# EAGLE board Arm_Board_2018 (EAGLE 8.2.2), part 1 of 2
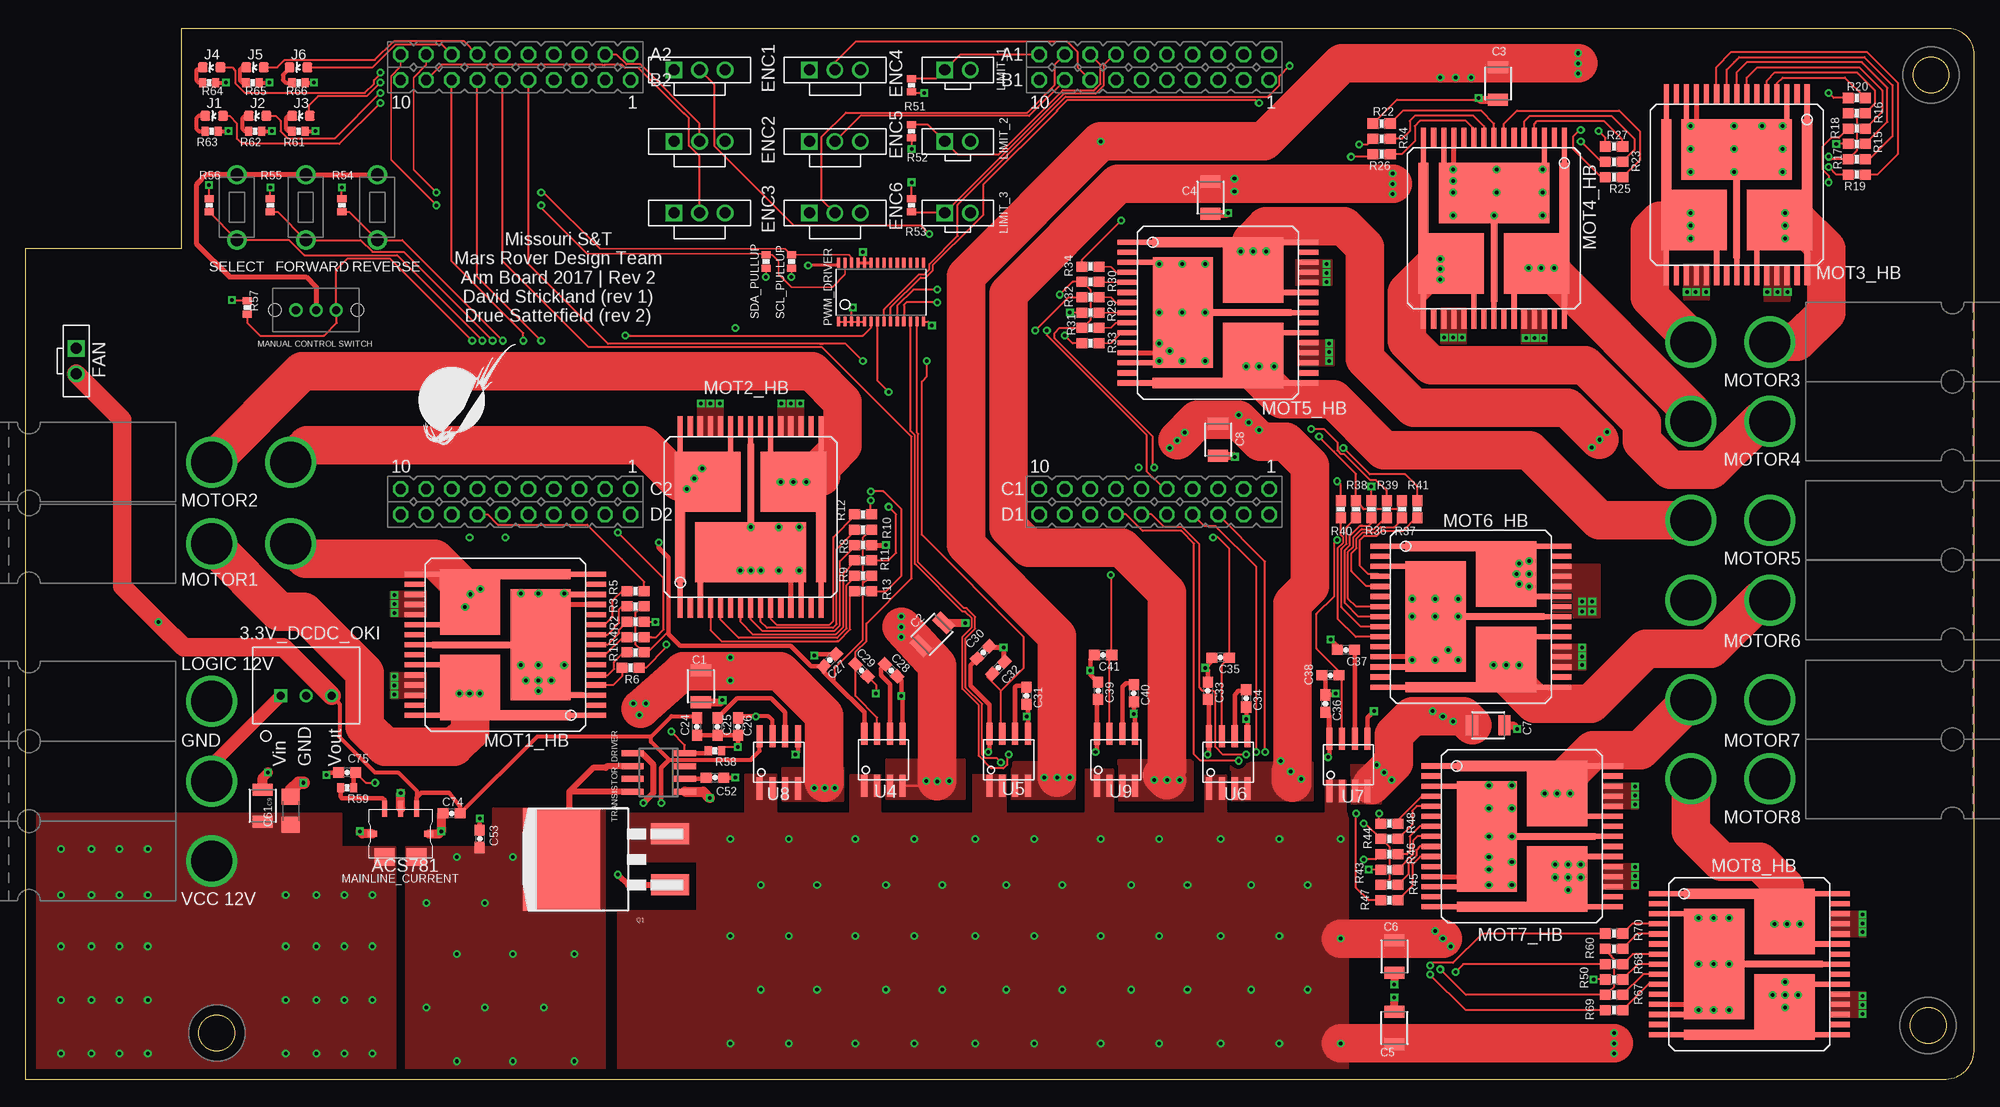
[diagram p4: board, top side]
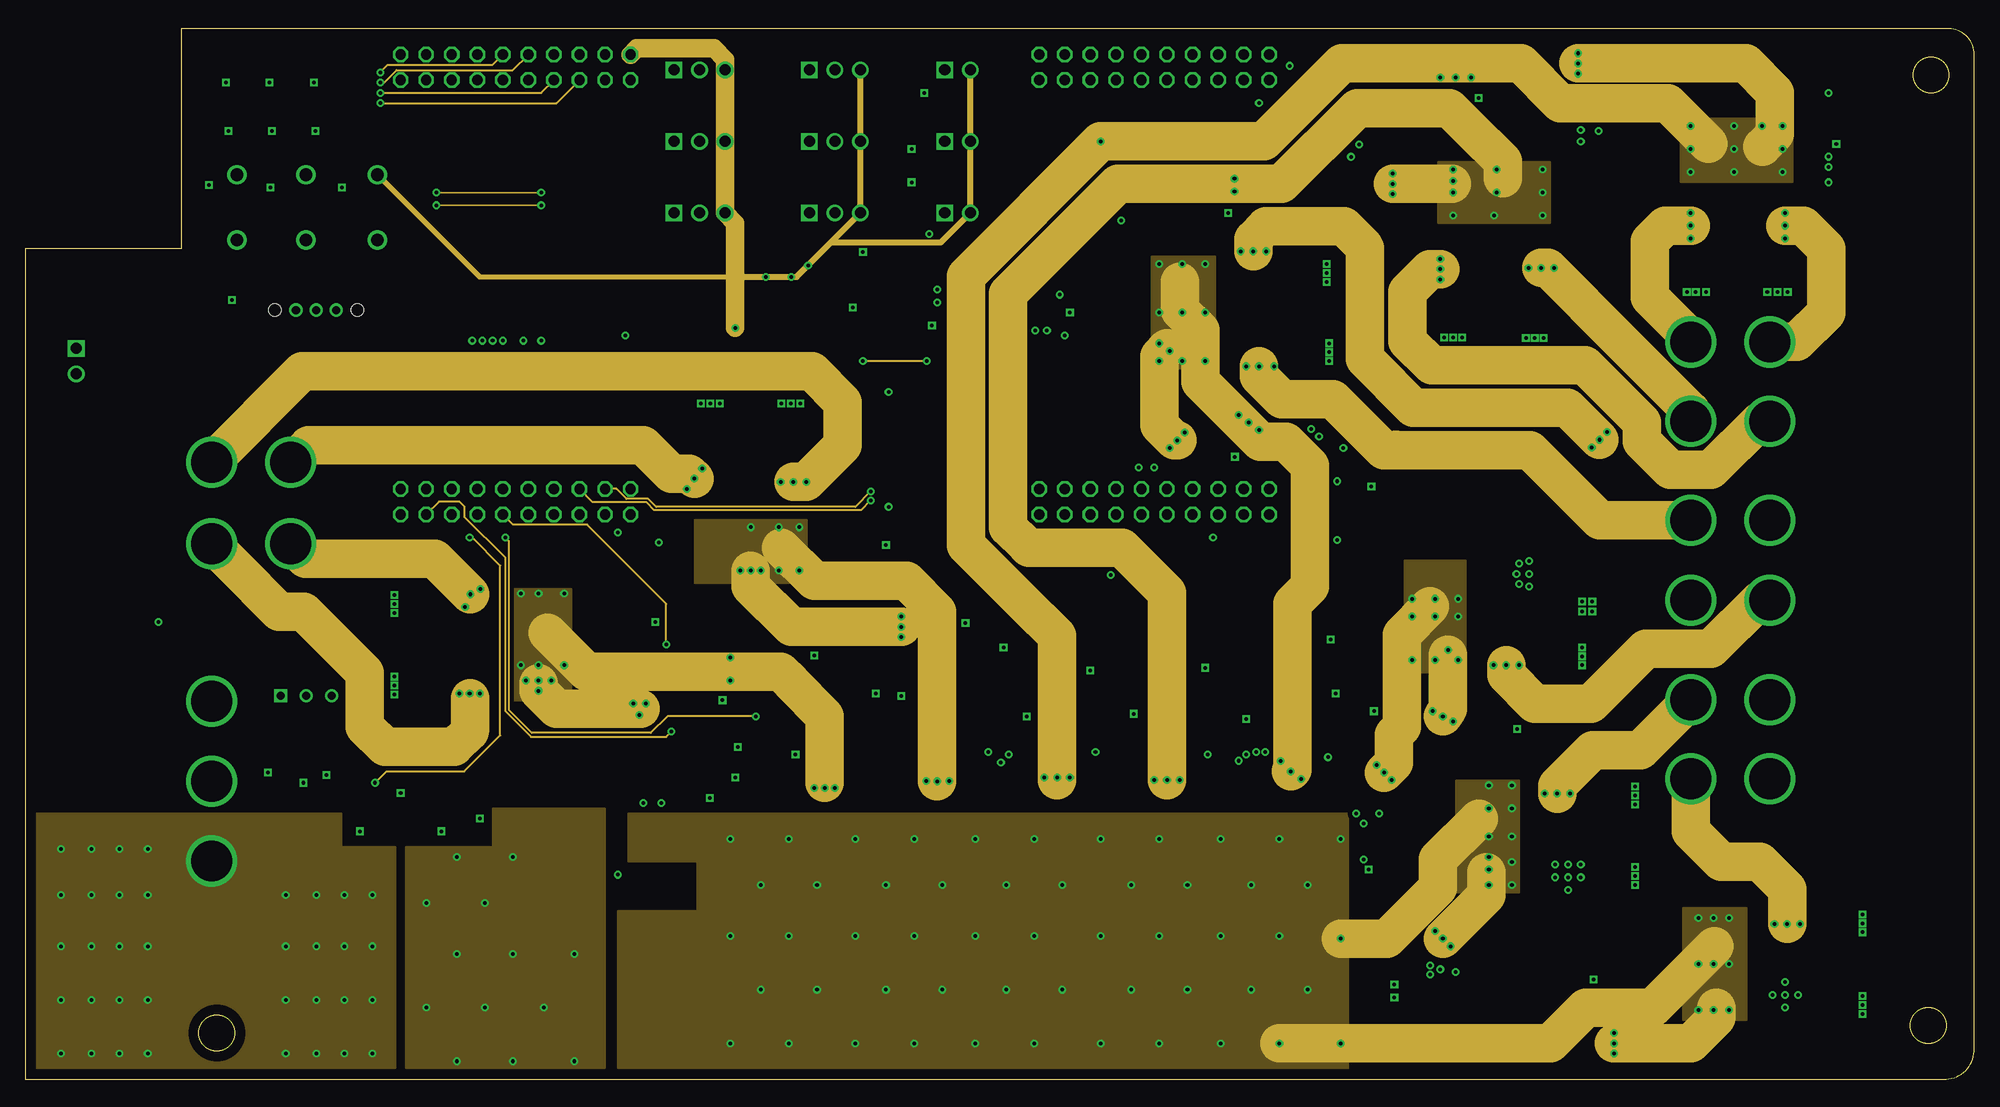
[diagram p5: board, inner layer Route2]
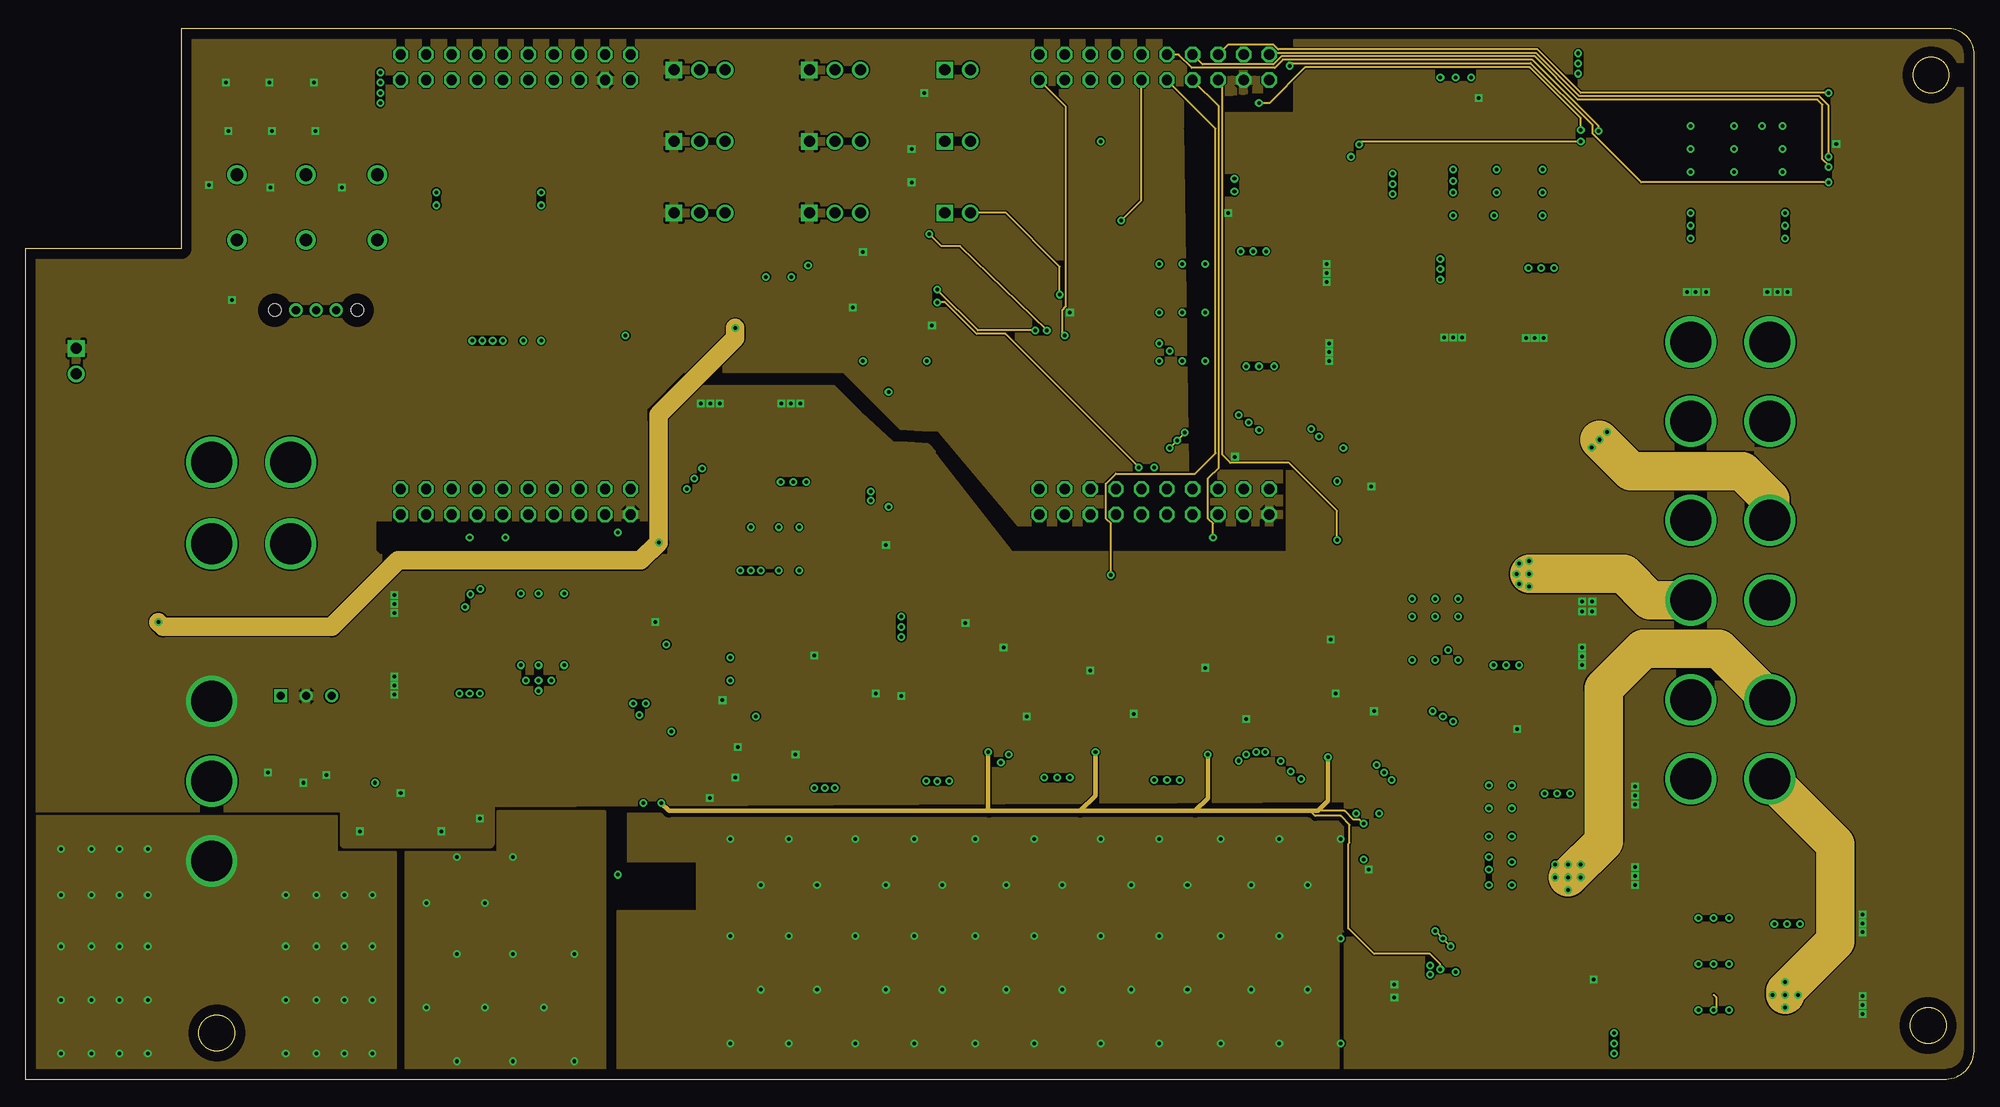
[diagram p6: board, inner layer Route15]
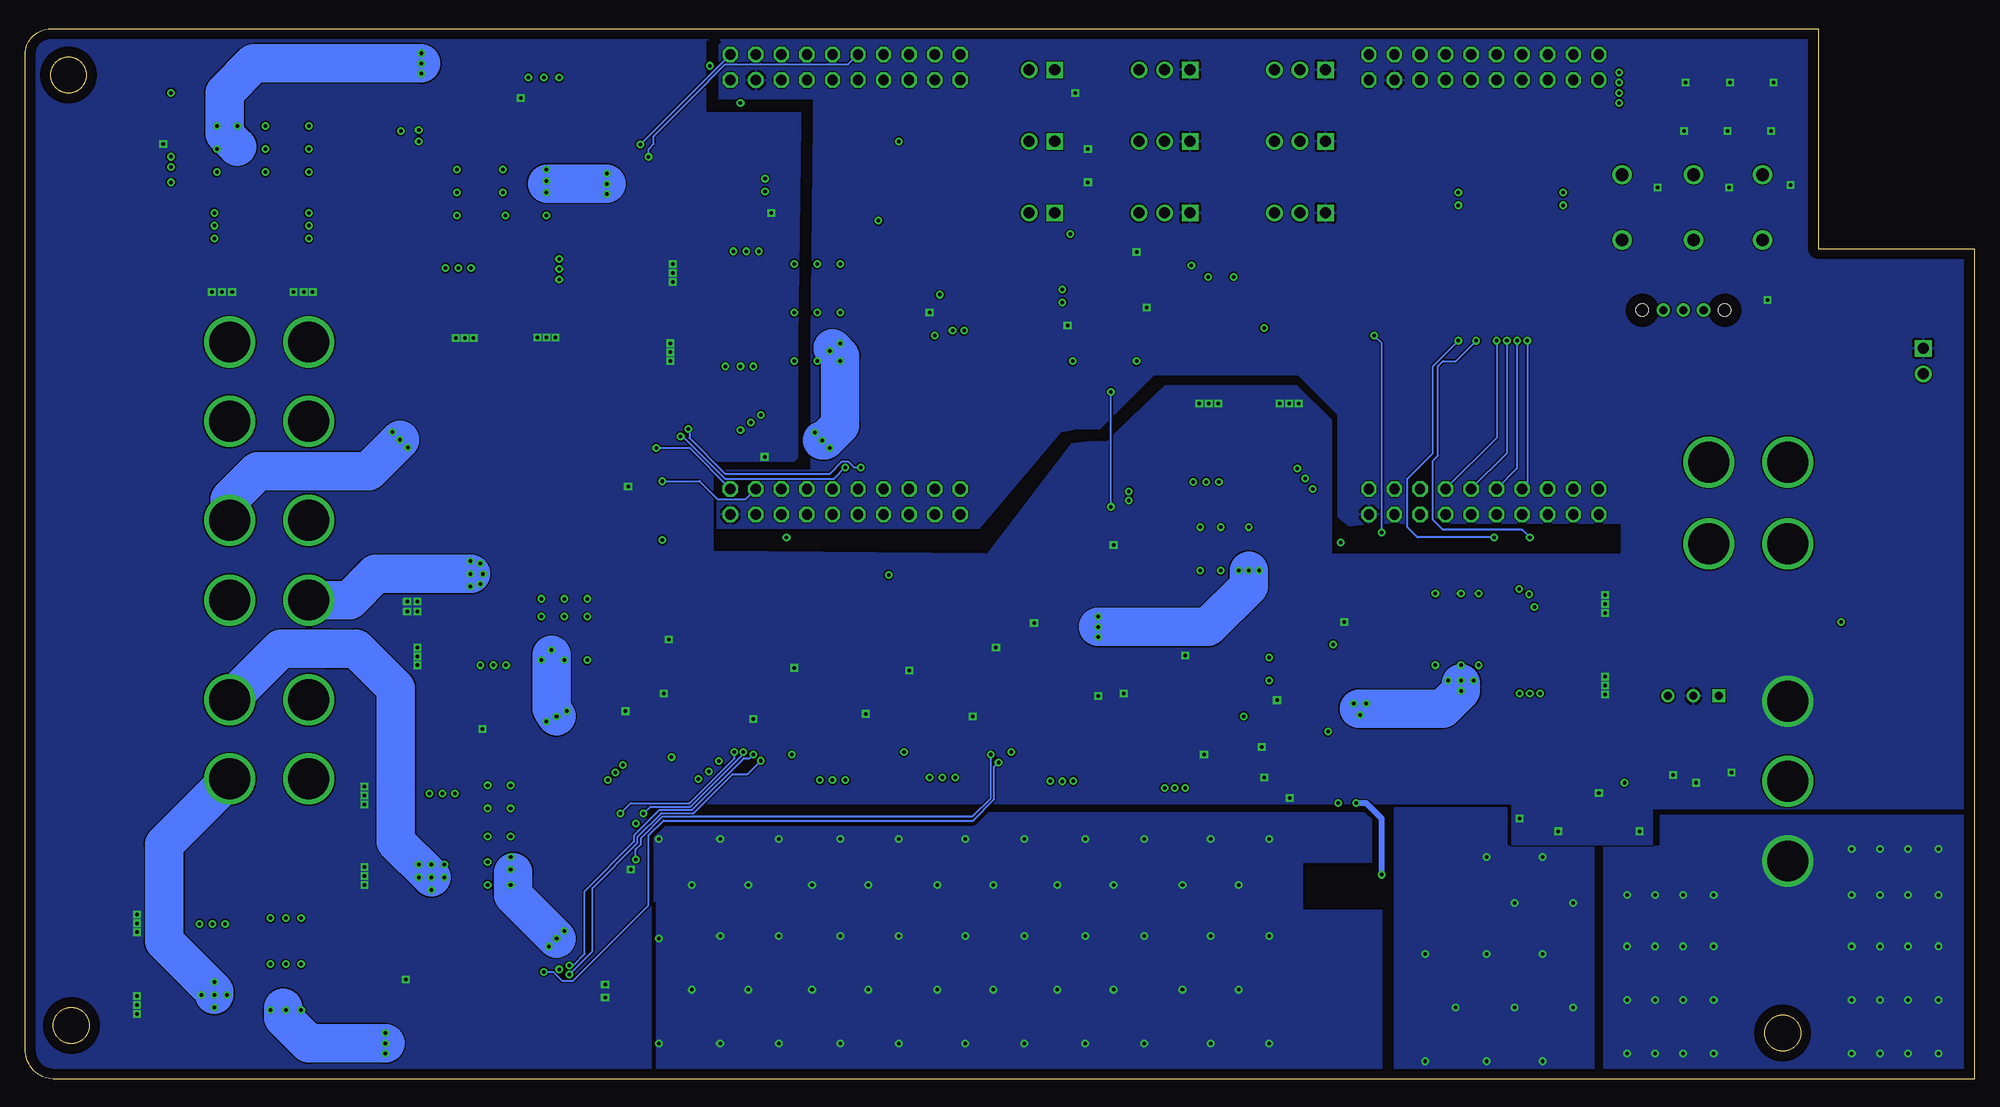
[diagram p7: board, bottom side, seen from below]

Size 193.81 x 104.39 mm. Coordinates in mm from the lower left corner, seen from the top.
Outline: 0,0 191.01,0 arc90 193.8,3.05 193.8,101.6 arc90 191.52,104.39 15.49,104.39 15.49,82.55 0,82.55 0,0
Copper layers (1*2*15*16): Top 0.07mm / dielectric 0.18mm / Route2 0.017mm / dielectric 1.12mm / Route15 0.017mm / dielectric 0.18mm / Bottom 0.07mm
Design rules "advanced_circuits_standard *": minimum track width 5mil, minimum drill 10mil, track to track 5mil, track to pad 5mil, pad to pad 5mil, via to via 5mil, smd to smd 5mil, copper to edge 40mil, drill to drill 5mil, minimum pad ring 10mil, minimum via ring 8mil, stop-mask expansion 4mil, vias tented up to drill 0mil, thermal gap 10mil
Net classes: 2 Ethernet: width 0.22 mm, clearance 0.152 mm; 3 Power Trace: width 1.829 mm, clearance 0.406 mm

## Footprints (pad centres in the part's own frame; a part is rotated, then mirrored left to right if it is on the bottom)
Q_OKI-78SR = drill 0.8 square: 1 -2.54,0 | drill 0.8: 2 0,0; 3 2.54,0
APP45_PCB_HORIZ_RIGHT = drill 4.064: P$1 28.194,3.969
1210 = smd 1.2 x 2: 1 -1.6,0; 2 1.6,0
0603-CAP = smd 1.1 x 1: 1 -0.85,0; 2 0.85,0
1206 = smd 1.6 x 1.8: 1 -1.4,0; 2 1.4,0
LED-0603 = smd 1 x 1: A 0,-0.877; C 0,0.877
MOLEX-70543-0002 = drill 1.1 square: 1 2.54,0 | drill 1.1: 2 0,0; 3 -2.54,0
MOLEX-70543-0001 = drill 1.1 square: 1 1.27,0 | drill 1.1: 2 -1.27,0
7-POWER_SMD_MODULE = smd 0.5 x 1.6: 1 -1.6,-2.5; 2 0,-2.5; 3 1.6,-2.5 | smd 0.9 x 0.6: 4 2.8,0; 7 -2.8,0 | smd 2 x 1.7: 5 1.6,2.3; 6 -1.6,2.3
MULTIPOWERSO-30 = smd 0.508 x 12: 1 -7,-4; 15 7,-4; 16 7,4; 30 -7,4 | smd 0.508 x 2: 2 -6,-9; 4 -4,-9; 5 -3,-9; 6 -2,-9; 7 -1,-9; 8 0,-9; 9 1,-9; 10 2,-9; 11 3,-9; 12 4,-9; 14 6,-9; 17 6,9; 18 5,9; 19 4,9; 20 3,9; 22 1,9; 24 -1,9; 26 -3,9; 27 -4,9; 28 -5,9; 29 -6,9 | smd 0.508 x 4: 3 -5,-8; 13 5,-8; 21 2,8; 23 0,8; 25 -2,8 | smd 6.5 x 6: OUTA -4.25,3.5; OUTB 4.25,3.5 | smd 1 x 7.5: OUTA@1 -7,-2.755; OUTB@1 7,-2.755 | smd 11 x 6: VCC 0,-3.5 | smd 0.65 x 8.3: VCC@1 0,3.145
APP45_HORIZ_CONFIG = drill 4.064: C1 28.194,3.937; C2 36.068,3.937
TSSOP28 = smd 0.305 x 0.991: 1 -4.225,-2.918; 2 -3.575,-2.918; 3 -2.925,-2.918; 4 -2.275,-2.918; 5 -1.625,-2.918; 6 -0.975,-2.918; 7 -0.325,-2.918; 8 0.325,-2.918; 9 0.975,-2.918; 10 1.625,-2.918; 11 2.275,-2.918; 12 2.925,-2.918; 13 3.575,-2.918; 14 4.225,-2.918; 15 4.225,2.918; 16 3.575,2.918; 17 2.925,2.918; 18 2.275,2.918; 19 1.625,2.918; 20 0.975,2.918; 21 0.325,2.918; 22 -0.325,2.918; 23 -0.975,2.918; 24 -1.625,2.918; 25 -2.275,2.918; 26 -2.925,2.918; 27 -3.575,2.918; 28 -4.225,2.918
D2PACK = smd 2.083 x 3.81: 1 2.54,-4.191; 2 7.62,-4.191 | smd 10.16 x 7.62: TAB 5.08,6.604
0603-RES = smd 1.1 x 1: 1 -0.85,0; 2 0.85,0
0402-RES = smd 0.7 x 0.9: 1 -0.65,0; 2 0.65,0
APEM-MJTP1243 = drill 1.27: P$1 -0.254,1.753; P$2 6.248,1.753
C&K-SS12D07VG4NSGAPA = drill 0.8: P$1 0,0; P$2 2,0; P$3 4,0 | hole 1.25: -2.1,0; 6.1,0
SO8 = smd 0.6 x 2.2: 1 -1.905,-2.6; 2 -0.635,-2.6; 3 0.635,-2.6; 4 1.905,-2.6; 5 1.905,2.6; 6 0.635,2.6; 7 -0.635,2.6; 8 -1.905,2.6
TIVA-C-CONNECTED = drill 1.016 octagon: +3V3_1 59.69,54.61; +3V3_2 123.19,54.61; +5V_1 59.69,52.07; +5V_2 123.19,52.07; GND_1 57.15,52.07; GND_2 59.69,8.89; GND_3 120.65,52.07; GND_4 123.19,8.89; PA4 39.37,52.07; PA5 36.83,52.07; PA6 105.41,52.07; PA7 52.07,8.89; PB2 102.87,54.61; PB3 100.33,54.61; PB4 54.61,52.07; PB5 52.07,52.07; PC4 118.11,54.61; PC5 115.57,54.61; PC6 113.03,54.61; PC7 105.41,54.61; PD0 107.95,8.89; PD1 110.49,8.89; PD2 57.15,54.61; PD3 107.95,54.61; PD4 49.53,54.61; PD5 46.99,54.61; PD7 107.95,52.07; PE0 118.11,52.07; PE1 115.57,52.07; PE2 113.03,52.07; PE3 110.49,52.07; PE4 120.65,54.61; PE5 110.49,54.61; PF1 123.19,11.43; PF2 120.65,11.43; PF3 118.11,11.43; PG0 115.57,11.43; PG1 59.69,11.43; PH0 44.45,11.43; PH1 41.91,11.43; PH2 118.11,8.89; PH3 115.57,8.89; PK0 49.53,52.07; PK1 46.99,52.07; PK2 44.45,52.07; PK3 41.91,52.07; PK4 57.15,11.43; PK5 54.61,11.43; PK6 39.37,11.43; PK7 36.83,11.43; PL0 107.95,11.43; PL1 105.41,11.43; PL2 102.87,11.43; PL3 100.33,11.43; PL4 113.03,11.43; PL5 110.49,11.43; PM0 52.07,11.43; PM1 49.53,11.43; PM2 46.99,11.43; PM3 120.65,8.89; PM4 102.87,52.07; PM5 100.33,52.07; PM6 36.83,8.89; PM7 57.15,8.89; PN2 105.41,8.89; PN3 102.87,8.89; PN4 36.83,54.61; PN5 39.37,54.61; PP0 54.61,54.61; PP1 52.07,54.61; PP2 100.33,8.89; PP3 41.91,8.89; PP4 41.91,54.61; PP5 54.61,8.89; PQ0 44.45,54.61; PQ1 39.37,8.89; PQ2/PA3 46.99,8.89; PQ3/PA2 44.45,8.89; RST1 49.53,8.89; RST_2 113.03,8.89
SOIC8 = smd 2.2 x 0.6: 1 -2.6,1.905; 2 -2.6,0.635; 3 -2.6,-0.635; 4 -2.6,-1.905; 5 2.6,-1.905; 6 2.6,-0.635; 7 2.6,0.635; 8 2.6,1.905

## Placement (x,y rotation side)
3.3V_DCDC_OKI  Q_OKI-78SR  [Q_OKI-78SR]  27.94,38.1 0 top
12V_LOGIC_IN  APPPP45_PCB_HORIZ_RIGHT  [APP45_PCB_HORIZ_RIGHT]  -9.65,25.65 0 top
C1  100uF  [1210]  67.18,39.05 270 top
C2  100uF  [1210]  90.18,44.23 45 top
C3  100uF  [1210]  146.45,98.97 270 top
C4  100uF  [1210]  117.86,87.63 270 top
C5  100uF  [1210]  136.14,5.08 90 top
C6  100uF  [1210]  136.14,12.19 270 top
C7  100uF  [1210]  145.48,35.18 0 top
C8  100uF  [1210]  118.62,63.56 270 top
C9  100uF  [1210]  23.62,27.18 270 top
C24  0.1uF  [0603-CAP]  66.8,35.05 90 top
C25  1nF  [0603-CAP]  68.83,35.05 270 top
C26  0.1uF  [0603-CAP]  70.87,35.05 270 top
C27  0.1uF  [0603-CAP]  80.01,41.66 225 top
C28  1nF  [0603-CAP]  86.11,40.64 315 top
C29  0.1uF  [0603-CAP]  83.16,40.64 315 top
C30  0.1uF  [0603-CAP]  95.25,42.42 225 top
C31  1nF  [0603-CAP]  99.57,38.1 270 top
C32  0.1uF  [0603-CAP]  96.77,40.89 45 top
C33  0.1uF  [0603-CAP]  117.6,38.61 270 top
C34  1nF  [0603-CAP]  121.41,37.85 270 top
C35  0.1uF  [0603-CAP]  118.87,41.91 180 top
C36  0.1uF  [0603-CAP]  129.29,37.34 270 top
C37  1nF  [0603-CAP]  131.32,42.67 180 top
C38  0.1uF  [0603-CAP]  129.79,40.13 180 top
C39  0.1uF  [0603-CAP]  106.68,38.61 270 top
C40  1nF  [0603-CAP]  110.24,38.35 270 top
C41  0.1uF  [0603-CAP]  107.19,42.16 180 top
C52  1.0uF  [0603-CAP]  68.58,29.97 0 top
C53  10uF  [0603-CAP]  45.21,23.88 270 top
C61  2.2uF  [1206]  26.42,26.67 270 top
C74  0.1uF  [0603-CAP]  42.42,26.42 180 top
C75  1nF  [0603-CAP]  32,30.48 180 top
D1  J1  [LED-0603]  18.8,95.76 90 top
D2  J2  [LED-0603]  23.11,95.76 90 top
D3  J3  [LED-0603]  27.43,95.76 90 top
D4  J4  [LED-0603]  18.54,100.58 90 top
D5  J5  [LED-0603]  22.86,100.58 90 top
D6  J6  [LED-0603]  27.18,100.58 90 top
ENC1  ENCODER  [MOLEX-70543-0002]  67.06,100.33 180 top
ENC2  ENCODER  [MOLEX-70543-0002]  67.06,93.22 180 top
ENC3  ENCODER  [MOLEX-70543-0002]  67.06,86.11 180 top
ENC4  ENCODER  [MOLEX-70543-0002]  80.52,100.33 180 top
ENC5  ENCODER  [MOLEX-70543-0002]  80.52,93.22 180 top
ENC6  ENCODER  [MOLEX-70543-0002]  80.52,86.11 180 top
FAN  SL02  [MOLEX-70543-0001]  5.08,71.37 90 top
GND  APPPP45_PCB_HORIZ_RIGHT  [APP45_PCB_HORIZ_RIGHT]  -9.65,33.59 0 top
H1  MOUNTING_HOLE#6  [#6_SCREW]  189.23,5.33 0 top
H2  MOUNTING_HOLE#6  [#6_SCREW]  19.05,4.57 0 top
H3  MOUNTING_HOLE#6  [#6_SCREW]  189.48,99.82 0 top
LIMIT_1  SL02  [MOLEX-70543-0001]  92.71,100.33 180 top
LIMIT_2  SL02  [MOLEX-70543-0001]  92.71,93.22 180 top
LIMIT_3  SL02  [MOLEX-70543-0001]  92.71,86.11 180 top
LOGO1  MRDT_LOGO  [MRDT_LOGO]  39.12,62.23 0 top
MAINLINE_CURRENT  ACS781  [7-POWER_SMD_MODULE]  37.34,24.38 180 top
MOT1_HB  VNH5019  [MULTIPOWERSO-30]  47.75,43.18 90 top
MOT2_HB  VNH5019  [MULTIPOWERSO-30]  72.14,55.88 0 top
MOT3_HB  VNH5019  [MULTIPOWERSO-30]  170.18,88.9 180 top
MOT4_HB  VNH5019  [MULTIPOWERSO-30]  146.05,84.58 180 top
MOT5_HB  VNH5019  [MULTIPOWERSO-30]  118.62,76.2 270 top
MOT6_HB  VNH5019  [MULTIPOWERSO-30]  143.76,45.97 270 top
MOT7_HB  VNH5019  [MULTIPOWERSO-30]  148.84,24.13 270 top
MOT8_HB  VNH5019  [MULTIPOWERSO-30]  171.45,11.43 270 top
MOTOR1  APP_2POS_CONFIGGENERAL_CONFIG  [APP45_HORIZ_CONFIG]  -9.65,49.28 0 top
MOTOR2  APP_2POS_CONFIGGENERAL_CONFIG  [APP45_HORIZ_CONFIG]  -9.65,57.4 0 top
MOTOR3  APP_2POS_CONFIGGENERAL_CONFIG  [APP45_HORIZ_CONFIG]  201.68,77.22 180 top
MOTOR4  APP_2POS_CONFIGGENERAL_CONFIG  [APP45_HORIZ_CONFIG]  201.68,69.34 180 top
MOTOR5  APP_2POS_CONFIGGENERAL_CONFIG  [APP45_HORIZ_CONFIG]  201.68,59.5 180 top
MOTOR6  APP_2POS_CONFIGGENERAL_CONFIG  [APP45_HORIZ_CONFIG]  201.68,51.56 180 top
MOTOR7  APP_2POS_CONFIGGENERAL_CONFIG  [APP45_HORIZ_CONFIG]  201.68,41.66 180 top
MOTOR8  APP_2POS_CONFIGGENERAL_CONFIG  [APP45_HORIZ_CONFIG]  201.68,33.78 180 top
POWER_12V  APPPP45_PCB_HORIZ_RIGHT  [APP45_PCB_HORIZ_RIGHT]  -9.65,17.72 0 top
PWM_DRIVER  [TSSOP28]  85.09,78.23 0 top
Q1  Q_IRF7437SMD  [D2PACK]  59.94,16.76 90 top
R1  1K  [0603-RES]  60.71,42.42 0 top
R2  1K  [0603-RES]  60.71,45.47 180 top
R3  1K  [0603-RES]  60.71,46.99 0 top
R4  1K  [0603-RES]  60.71,43.94 0 top
R5  1K  [0603-RES]  60.71,48.51 0 top
R6  1K  [0603-RES]  60.2,40.89 0 top
R8  1K  [0603-RES]  83.31,53.09 180 top
R9  1K  [0603-RES]  83.31,50.04 0 top
R10  1K  [0603-RES]  83.31,54.61 0 top
R11  1K  [0603-RES]  83.31,51.56 0 top
R12  1K  [0603-RES]  83.31,56.13 0 top
R13  1K  [0603-RES]  83.31,48.51 0 top
R15  1K  [0603-RES]  182.12,92.96 0 top
R16  1K  [0603-RES]  182.12,96.01 180 top
R17  1K  [0603-RES]  182.12,91.44 180 top
R18  1K  [0603-RES]  182.12,94.49 180 top
R19  1K  [0603-RES]  182.12,89.92 180 top
R20  1K  [0603-RES]  182.12,97.54 180 top
R22  1K  [0603-RES]  134.87,95 0 top
R23  1K  [0603-RES]  157.99,91.19 180 top
R24  1K  [0603-RES]  134.87,93.47 180 top
R25  1K  [0603-RES]  157.99,89.66 180 top
R26  1K  [0603-RES]  134.87,91.95 180 top
R27  1K  [0603-RES]  157.99,92.71 180 top
R29  1K  [0603-RES]  105.92,76.2 0 top
R30  1K  [0603-RES]  105.92,79.25 180 top
R31  1K  [0603-RES]  105.92,74.68 180 top
R32  1K  [0603-RES]  105.92,77.72 180 top
R33  1K  [0603-RES]  105.92,73.15 180 top
R34  1K  [0603-RES]  105.92,80.77 180 top
R36  1K  [0603-RES]  133.86,56.64 270 top
R37  1K  [0603-RES]  136.91,56.64 90 top
R38  1K  [0603-RES]  132.33,56.64 90 top
R39  1K  [0603-RES]  135.38,56.64 90 top
R40  1K  [0603-RES]  130.81,56.64 90 top
R41  1K  [0603-RES]  138.43,56.64 90 top
R43  1K  [0603-RES]  135.64,20.83 0 top
R44  1K  [0603-RES]  135.64,23.88 180 top
R45  1K  [0603-RES]  135.64,19.3 180 top
R46  1K  [0603-RES]  135.64,22.35 180 top
R47  1K  [0603-RES]  135.64,17.78 180 top
R48  1K  [0603-RES]  135.64,25.4 180 top
R50  1K  [0603-RES]  157.99,9.91 0 top
R51  10K  [0402-RES]  88.14,98.81 90 top
R52  10K  [0402-RES]  88.14,94.23 90 top
R53  10K  [0402-RES]  88.14,86.87 270 top
R54  10k  [0402-RES]  31.5,86.87 90 top
R55  10k  [0402-RES]  24.38,86.87 90 top
R56  10k  [0402-RES]  18.29,86.87 90 top
R57  10k  [0402-RES]  22.1,76.71 90 top
R58  10K  [0402-RES]  68.58,32.64 180 top
R59  1K  [0402-RES]  32,28.96 180 top
R60  1K  [0603-RES]  157.99,12.95 180 top
R61  330  [0402-RES]  27.18,94.23 180 top
R62  330  [0402-RES]  22.86,94.23 180 top
R63  330  [0402-RES]  18.54,94.23 180 top
R64  330  [0402-RES]  18.29,99.06 180 top
R65  330  [0402-RES]  22.61,99.06 180 top
R66  330  [0402-RES]  27.18,99.06 180 top
R67  1K  [0603-RES]  157.99,8.38 180 top
R68  1K  [0603-RES]  157.99,11.43 180 top
R69  1K  [0603-RES]  157.99,6.86 180 top
R70  1K  [0603-RES]  157.99,14.48 180 top
S2  PUSHBUTTONVERT  [APEM-MJTP1243]  19.3,89.66 270 top
S3  PUSHBUTTONVERT  [APEM-MJTP1243]  26.16,89.66 270 top
S4  PUSHBUTTONVERT  [APEM-MJTP1243]  33.27,89.66 270 top
S5  SWITCH-SPDTVERT  [C&K-SS12D07VG4NSGAPA]  26.92,76.45 0 top
SCL_PULLUP  1K  [0402-RES]  76.2,81.28 90 top
SDA_PULLUP  1K  [0402-RES]  73.66,81.28 90 top
TRANSISTOR_DRIVER  LT1910  [SO8]  62.99,30.48 90 top
U1  TIVA-1294  [TIVA-C-CONNECTED]  0.51,47.24 0 top
U4  ACS722  [SOIC8]  85.34,31.75 90 top
U5  ACS722  [SOIC8]  97.79,31.75 90 top
U6  ACS722  [SOIC8]  119.63,31.5 90 top
U7  ACS722  [SOIC8]  131.57,31.24 90 top
U8  ACS722  [SOIC8]  74.93,31.5 90 top
U9  ACS722  [SOIC8]  108.46,31.75 90 top

## Tracks (layer width: path | path; a pad name or v marks a point on that pad's centre or on a via)
12VMOTOR_POWER  (via drill 0.35)  (2 unrouted)
  Top 0.152: v167.89,6.86 167.95,6.91 MOT8_HB.VCC 167.95,8.44 v166.37,6.86
  Top 0.203: MOT7_HB.3 140.92,29.21 142.75,29.21 145.34,26.61 MOT7_HB.VCC 145.34,23.76 | 145.54,24.89 146.05,24.38 147.57,24.38 v147.83,24.13 MOT7_HB.VCC@1 MOT7_HB.23 | MOT8_HB.13 166.2,6.43 v167.89,6.86 | MOT8_HB.VCC 167.95,15.18 166.88,16.26 166.12,16.26 165.86,16.51 163.53,16.51 MOT8_HB.3 | MOT8_HB.VCC MOT8_HB.VCC@1 MOT8_HB.23 | MOT8_HB.VCC 167.95,8.58 | 167.95,7.31 168.15,7.11 | v157.99,4.57 v157.99,3.56 v157.99,2.54 | 143.51,19.3 143.34,19.13 142.57,19.13 | 142.57,19.13 MOT7_HB.13 | 142.57,19.13 v145.54,20.83 | MOT8_HB.VCC 168.66,12.14 168.66,13.97
  Top 0.457: MOT8_HB.VCC 166.93,12.45 166.93,13.97
  Top 0.508: MOT7_HB.12 143.57,20.13 | v145.54,20.83 143.57,20.13 | 145.54,24.89 145.34,24.69 MOT7_HB.VCC 145.34,25.09 143.51,26.92 | 143.51,19.3 143.51,20.07 143.57,20.13 | MOT8_HB.12 166.56,7.43 v167.89,6.86
  Top 0.813: C6.1 135.71,14.3 135.38,13.97 | C5.1 136.14,3.56
  Top 3.81: MOT7_HB.VCC 145.34,20.63 145.29,20.57 | v140.97,13.97 135.38,13.97 v130.81,13.97 | v130.81,3.56 136.14,3.56 v157.99,3.56
  Route2 0.203: 168.66,13.97 168.97,13.66 168.97,12.19
  Route2 3.81: 145.29,20.57 145.29,18.29 v140.97,13.97 | v130.81,13.97 135.38,13.97 140.46,19.05 140.46,21.84 144.53,25.91 | 168.15,7.11 168.15,6.1 165.61,3.56 v157.99,3.56 | v124.71,3.56 151.64,3.56 155.19,7.11 161.85,7.11 167.95,13.21
  Route15 0.203: 168.15,7.11 168.15,8.13 167.89,8.38 | v141.73,13.21 v140.97,13.97 v140.21,14.73
  Bottom 3.81: v140.97,13.97 145.29,18.29 145.29,20.57 | v157.99,3.56 165.61,3.56 168.15,6.1 168.15,7.11
  other vias: 78.74,19.3 73.15,19.3 78.74,8.89 73.15,8.89 75.95,14.22 70.1,14.22 75.95,3.56 70.1,3.56 75.95,23.88 70.1,23.88 91.19,19.3 85.6,19.3 91.19,8.89 85.6,8.89 88.39,14.22 82.55,14.22 88.39,3.56 82.55,3.56 88.39,23.88 82.55,23.88 103.12,19.3 97.54,19.3 103.12,8.89 97.54,8.89 100.33,14.22 94.49,14.22 100.33,3.56 94.49,3.56 100.33,23.88 94.49,23.88 115.57,19.3 109.98,19.3 115.57,8.89 109.98,8.89 112.78,14.22 106.93,14.22 112.78,3.56 106.93,3.56 112.78,23.88 106.93,23.88 127.51,19.3 121.92,19.3 127.51,8.89 121.92,8.89 124.71,14.22 118.87,14.22 118.87,3.56 124.71,23.88 118.87,23.88 130.81,23.88 145.54,19.3 147.83,29.21 147.83,26.92 147.83,21.59 147.83,19.3 145.54,22.1 145.54,24.13 145.54,26.92 145.54,29.21 169.42,6.86 169.42,11.43 167.89,11.43 166.37,11.43 169.42,16 167.89,16 166.37,16
  pour Top (no thermals): 117.35,26.16 117.35,30.23 119.38,30.23 119.38,26.16
  pour Top (no thermals): 97.54,26.42 97.54,30.23 94.23,30.23 94.23,26.42
  pour Top (no thermals): 74.68,30.23 71.63,30.23 71.63,26.16 74.68,26.16
  pour Top (no thermals): 85.01,30.25 85.01,25.7 82.07,25.7 82.07,30.25
  pour Top (no thermals): 108.2,26.16 108.2,30.73 105.41,30.73 105.41,26.16
  pour Top (no thermals): 129.29,29.72 131.32,29.72 131.32,26.16 129.29,26.16
  pour Top (no thermals): 59.94,26.42 59.94,21.59 66.8,21.59 66.8,16.76 58.93,16.76 58.93,1.02 131.57,1.02 131.57,26.42
  pour Route2 (no thermals): 59.94,26.42 59.94,21.59 66.8,21.59 66.8,16.76 58.93,16.76 58.93,1.07 131.57,1.02 131.57,26.42
  pour Bottom (rank 2): 59.94,26.42 131.57,26.42 131.57,1.02 58.93,1.02 58.93,16.76 66.8,16.76 66.8,21.59 59.94,21.59
  pour Route15 (rank 2): 59.94,26.42 131.57,26.42 131.57,1.02 58.93,1.02 58.93,16.76 66.8,16.76 66.8,21.59 59.94,21.59
  pour Route2: 142.24,29.72 142.24,18.54 148.59,18.54 148.59,29.72
  pour Route2: 164.85,17.02 164.85,5.84 171.2,5.84 171.2,17.02
BUTTON1  (via drill 0.35)
  Top 0.203: v45.47,73.41 36.97,81.9 27.76,81.9 26.24,83.41 S2.P$2 21.06,83.45 R56.1 18.25,86.22
  Bottom 0.203: v45.47,73.41 45.47,60.71 U1.PM2
BUTTON2  (via drill 0.35)
  Top 0.203: v46.48,73.41 37.66,82.23 34.54,82.23 33.36,83.41 S3.P$2 25.11,86.22 R55.1
  Bottom 0.203: v46.48,73.41 46.48,62.23 U1.PM1
BUTTON3  (via drill 0.35)
  Top 0.203: v47.5,73.41 37.49,83.41 S4.P$2 32.22,86.22 R54.1
  Bottom 0.203: v47.5,73.41 47.5,63.75 U1.PM0
ENCODER_1  (via drill 0.35)
  Top 0.203: 101.62,73.94 111.51,64.05 111.51,60.45 113.28,58.67 U1.PL4 | 101.62,73.94 101.6,73.95 | ENC1.2 68.54,98.84 68.54,92.75 76.45,84.84 89.08,84.84 v89.92,84 | v101.6,74.42 101.6,73.95 | 101.6,73.95 101.62,73.94
  Route15 0.203: v101.6,74.42 92.96,82.8 91.11,82.8 v89.92,84
ENCODER_2
  Top 0.203: U1.PD2 58.8,101.85 59.79,100.86 61.19,100.86 67.06,95 ENC2.2
ENCODER_3
  Top 0.203: U1.PA4 41.4,100.84 57.4,100.84 57.63,100.84 59.35,100.84 59.65,100.53 60.95,100.53 65.47,96.01 65.53,96.01 66,95.54 66,92.78 67.06,91.73 ENC3.2
ENCODER_4
  Top 0.203: U1.PA6 104.65,100.58 104.65,102.11 103.63,103.12 82.55,103.12 80.52,101.09 ENC4.2
ENCODER_5
  Top 0.203: ENC5.2 83.06,95.76 99.82,95.76 U1.PM4
ENCODER_6
  Top 0.203: U1.PB2 102.36,100.84 102.36,98.81 99.64,96.09 81.61,96.09 79.21,93.69 79.21,87.41 ENC6.2
GND  (via drill 0.35)
  Top 0.203: MAINLINE_CURRENT.4 | MAINLINE_CURRENT.7 | C29.2 84.58,39.22 v84.58,38.35 | 99.69,36.07 v99.58,36.07 | R58.1 69.23,32.65 69.6,33.02 v70.86,33.02 v70.87,33.02 | R50.1 v155.96,9.91 | R43.1 v133.6,20.83 | R36.1 v133.86,58.93 | R15.1 v180.09,92.96 | R29.1 v103.89,76.2 | R2.1 62.65,45.47 v62.67,45.44 | R54.2 v31.5,88.65 | R55.2 v24.38,88.65 | R56.2 v18.29,88.9 | R51.1 87.74,98.04 v89.41,98.04 | R52.1 v88.14,92.46 | R53.1 v88.14,89.15 | PWM_DRIVER.24 83.47,82.06 v83.31,82.22 | PWM_DRIVER.1 PWM_DRIVER.2 PWM_DRIVER.3 | PWM_DRIVER.3 PWM_DRIVER.4 PWM_DRIVER.5 | PWM_DRIVER.3 82.17,76.58 v82.3,76.71 | PWM_DRIVER.14 89.79,75.31 v90.17,74.93 | R22.1 136.4,97.37 144.69,97.37 | R57.2 20.69,77.36 v20.57,77.47
  Top 0.305: PWM_DRIVER.25 PWM_DRIVER.24 PWM_DRIVER.23
  Top 0.406: R66.1 v28.7,99.06 | R65.1 v24.28,99.06 | R64.1 v19.96,99.06 | R61.1 v28.85,94.23 | R62.1 v24.54,94.23 | R63.1 v20.22,94.23
  Top 0.457: C52.2 v70.61,29.97 | C53.1 v45.21,25.91 | C75.2 30.23,30.48 v29.97,30.23 | C24.1 C25.2 C26.2 v70.87,33.02 | U4.5 87.25,37.98 v87.13,38.1 87.13,39.61 C28.2 | U5.5 99.69,36.07 99.69,37.12 C31.2 | C40.2 v110.24,36.32 110.36,36.2 U9.5 | C34.2 121.42,36.98 v121.42,35.81 121.54,35.7 U6.5 | 95.85,42.83 C30.1 | U8.5 76.83,32.49 v76.6,32.26 | C27.1 78.63,42.26 v78.49,42.11 | C39.1 105.92,40.22 v105.92,40.64 105.92,41.74 C41.2 | C33.1 117.6,40.64 v117.35,40.89 118.02,41.57 C35.2 | C37.2 130.47,43.01 v129.79,43.69 | U7.5 133.48,35.94 v134.11,36.58 | C38.2 129.29,39.79 C36.1 130.14,38.19 v130.3,38.35
  Top 0.508: R8.1 v85.6,53.09 | C32.2 97.28,41.59 v97.28,42.93 95.94,42.93 C30.1
  Top 0.813: C7.2 147.96,35.18 v148.34,34.8 | C6.2 v136.14,9.4 | C5.2 v136.14,8.13 | C8.2 120.19,61.96 v120.29,61.87 | C4.2 119.56,86.03 v119.63,86.11 | C3.2 144.69,97.37 v144.53,97.54 | C1.2 69.13,37.45 v69.34,37.67 | C2.2 v93.5,45.36
  Top 0.914: MAINLINE_CURRENT.2 v37.34,28.45 | MAINLINE_CURRENT.7 41.15,24.38 v41.4,24.64 41.4,26.25 C74.2 | MAINLINE_CURRENT.4 33.53,24.38 v33.27,24.64
  Top 1.016: TRANSISTOR_DRIVER.1 67.44,28.57 v68.07,27.94 | C9.1 23.62,29.97 v24.13,30.48
  Top 1.219: C61.1 26.42,28.7 27.18,29.46 v27.69,29.46
  other vias: 36.7,40.01 36.7,39.12 36.7,38.23 36.7,48.13 36.7,47.24 36.7,46.35 67.18,67.18 69.09,67.18 68.14,67.18 75.18,67.18 77.09,67.18 76.14,67.18 167.13,78.23 166.12,78.23 165.23,78.23 173.23,78.23 174.24,78.23 175.26,78.23 151,73.66 150.11,73.66 149.22,73.66 142.88,73.72 141.99,73.72 141.1,73.72 129.41,81.03 129.41,80.14 129.41,79.25 129.67,73.15 129.67,72.26 129.67,71.37 154.81,42.93 154.81,42.04 154.81,41.15 154.81,47.5 154.81,46.48 155.83,47.5 155.83,46.48 160.08,29.08 160.08,28.19 160.08,27.3 160.08,21.08 160.08,20.19 160.08,19.3 182.69,16.38 182.69,15.49 182.69,14.61 182.69,8.26 182.69,7.37 182.69,6.48
  pour Bottom: -2.29,84.33 -2.67,98.3 -2.41,104.52 -2.29,104.65 4.57,106.81 36.32,107.7 197.36,105.66 196.09,-2.03 131.57,-1.78 131.57,27.43 45.97,27.43 45.97,23.37 32,23.37 32,26.92 -2.29,26.92
  pour Route15: -2.79,26.92 -2.79,97.54 -2.54,104.9 4.57,104.9 39.37,106.93 201.42,106.93 197.36,-1.52 197.1,-1.78 131.57,-1.27 131.57,27.94 46.23,27.43 46.23,23.37 31.75,23.37 31.75,26.92
  cutout Bottom: 35.31,52.32 63.75,52.32 63.75,65.53 67.31,69.09 80.52,69.09 86.36,63.5 87.63,63.5 89.92,63.25 98.3,52.32 125.22,52.58 125.22,60.71 115.82,60.71 115.82,73.41 115.57,95 115.57,97.28 124.97,97.28 124.97,102.87 124.71,103.12 124.97,103.38 125.98,103.12 125.98,96.27 116.59,96.27 116.59,95 116.84,73.41 116.84,61.72 117.35,61.21 125.22,61.21 125.22,54.61 98.81,54.61 90.68,64.26 89.41,64.52 86.87,64.52 81.53,69.85 67.31,69.85 63.5,66.04 63.5,55.88 62.23,54.86 60.2,55.12 35.31,55.12
  cutout Route15: 35.05,55.37 62.23,55.37 61.98,66.55 65.53,70.1 81.28,70.1 86.87,64.52 90.68,64.26 98.55,54.86 125.22,54.86 125.22,61.47 125.22,61.21 117.35,61.21 116.84,61.72 116.33,94.49 116.33,96.27 125.98,96.27 125.98,103.12 124.97,103.12 124.97,98.04 115.32,97.28 115.32,94.49 115.82,60.71 125.22,60.71 125.22,52.58 98.3,52.58 90.93,61.98 90.68,62.23 90.68,62.48 89.92,63.25 86.36,63.5 83.31,66.29 80.52,69.09 67.31,69.09 63.75,65.79 63.75,52.32 35.31,52.32 35.05,52.58
  pour Top (no thermals): 39.88,40.39 36.32,40.39 36.32,37.85 39.88,37.85
  pour Top (no thermals): 39.88,48.51 36.32,48.51 36.32,45.97 39.88,45.97
  pour Top (no thermals): 66.87,67.44 66.87,63.88 69.41,63.88 69.41,67.44
  pour Top (no thermals): 74.87,67.44 74.87,63.88 77.41,63.88 77.41,67.44
  pour Top (no thermals): 167.45,77.47 167.45,81.03 164.91,81.03 164.91,77.47
  pour Top (no thermals): 175.45,77.34 175.45,80.9 172.91,80.9 172.91,77.34
  pour Top (no thermals): 151.32,73.03 151.32,76.58 148.78,76.58 148.78,73.03
  pour Top (no thermals): 143.32,73.09 143.32,76.64 140.78,76.64 140.78,73.09
  pour Top (no thermals): 129.92,81.47 126.36,81.47 126.36,78.93 129.92,78.93
  pour Top (no thermals): 130.11,73.47 126.56,73.47 126.56,70.93 130.11,70.93
  pour Top (no thermals): 155.26,43.24 151.7,43.24 151.7,40.7 155.26,40.7
  pour Top (no thermals): 156.59,51.18 151.76,51.18 151.76,45.85 156.59,45.85
  pour Top (no thermals): 160.4,29.4 156.84,29.4 156.84,26.86 160.4,26.86
  pour Top (no thermals): 160.4,21.4 156.84,21.4 156.84,18.86 160.4,18.86
  pour Top (no thermals): 183.01,8.7 179.45,8.7 179.45,6.16 183.01,6.16
  pour Top (no thermals): 183.01,16.7 179.45,16.7 179.45,14.16 183.01,14.16
LED1  (via drill 0.35)
  Top 0.203: D1.A 20.32,95.76 21.08,95 21.08,93.47 21.59,92.96 31.24,92.96 v35.31,97.03
  Route2 0.203: v35.31,97.03 52.83,97.03 U1.PB4
LED2  (via drill 0.35)
  Top 0.203: 24.13,95.76 D2.A 24.89,95.76 25.4,95.25 25.4,94.24 26.08,93.56 30.82,93.56 v35.31,98.04
  Route2 0.203: v35.31,98.04 51.31,98.04 U1.PB5
LED3  (via drill 0.35)
  Top 0.203: v35.31,99.06 33.96,97.71 29.13,97.71 28.19,96.77 28.19,95.87 D3.A
  Route2 0.203: v35.31,99.06 35.68,99.06 36.93,100.31 48.49,100.31 U1.PD4
LED4  (via drill 0.35)
  Top 0.203: D4.A 20.57,100.58 20.9,100.25 20.9,98.98 21.84,98.04 33.78,98.04 34.7,98.96 34.7,99.31 35.31,99.92 v35.31,100.08
  Route2 0.203: U1.PD5 46.48,100.84 36.07,100.84 v35.31,100.08
LED5
  Top 0.203: D5.A 25.07,100.58 25.79,101.31 34.77,101.31 36.58,103.12 36.62,103.12 36.69,103.2 43.61,103.2 U1.PQ0
LED6
  Top 0.203: D6.A 34.54,100.58 36.83,102.87 41.4,102.87 U1.PP4
LIMIT_SWITCH_1
  Top 0.203: U1.PB3 92.96,101.85 LIMIT_1.1 90.57,99.46 R51.2
LIMIT_SWITCH_2
  Top 0.203: U1.PC7 106.93,100.84 106.93,98.93 106.49,98.49 106.33,98.32 103.19,98.32 96.81,91.95 92.71,91.95 LIMIT_2.1 89.77,94.88 R52.2
LIMIT_SWITCH_3
  Top 0.203: U1.PD3 108.28,101.85 107.26,100.84 107.26,98.79 106.47,97.99 103.33,97.99 LIMIT_3.1 88.25,86.11 R53.2
LOGIC_3.3V  (via drill 0.35)
  Top 0.152: SDA_PULLUP.1 v73.66,79.76 | SCL_PULLUP.1 v76.2,79.76
  Top 0.203: R38.2 132.33,57.66 | 80.52,39.37 80.52,40.89 83.31,43.69 83.31,49.28 | 83.31,49.28 R9.2 | 83.31,49.28 83.31,53.85 R10.2 | R45.2 135.64,19.81 135.64,23.11 R44.2 133.26,25.4 v133.1,25.4 | R60.2 157.91,12.03 157.92,12.03 157.92,12.02 157.99,11.94 157.99,9.14 R67.2 143.26,8.38 v140.72,10.92 | R37.2 136.4,56.64 133.1,56.64 132.33,57.66 | R1.2 60.71,43.18 60.71,46.48 R3.2 | 105.26,74.85 R31.2 | 105.26,74.85 105.92,75.44 105.92,78.49 R30.2 104.14,79.25 v102.87,77.98 | R23.2 156.72,91.19 v154.69,93.22 | R16.2 181.61,96.01 182.12,95.5 182.12,92.29 R17.2 179.58,91.44 v179.32,91.69 | v128.65,63.88 130.14,62.39 130.14,62.36 132.33,60.16 132.33,57.66 | 105.26,74.85 105.09,74.68 102.87,74.68 102.36,74.17 102.36,73.66 112.14,63.88 112.14,60.93 v112.27,60.8 | v132.65,92.91 133.46,92.91 R24.2
  Top 0.254: R1.2 61.9,42.42 64,44.52 | 63.99,46.99 64,47
  Top 0.305: PWM_DRIVER.28 80.61,80.9 v77.85,80.9
  Top 0.406: 3.3V_DCDC_OKI.3 31.27,37.31 31.27,34.01 34.77,30.5 37.08,30.5 38.94,28.65 38.94,27.59 | 66.8,36.08 64.27,36.08 62.26,34.06 62.18,34.06 | C74.1 50.91,34.06 62.18,34.06 | U8.8 73.03,32.64 72.13,31.75 64.01,31.75 62.23,33.53 62.23,34.01 62.18,34.06
  Top 0.457: MAINLINE_CURRENT.1 38.94,27.59 38.94,28.02 39.37,28.45 42.16,28.45 43.27,27.09 C74.1 | 66.8,36.08 C24.2 | U4.8 83.44,36.45 80.52,39.37 79.41,40.48 C27.2 78.14,41.05 76.12,43.08 65.13,43.08 64,44.2 64,44.52 64,47 64,51.82 62.99,52.83 v62.99,53.34 | v106.43,32.51 106.55,32.64 U9.8 106.55,37.63 C39.2 | v63.25,27.43 63.25,30.98 64.01,31.75 | v95.76,32.51 95.89,32.64 U5.8 95.89,37.21 93.98,39.12 93.98,41.15 C30.2 | v117.6,32.26 117.73,32.38 U6.8 117.73,37.63 C33.2 | U7.8 129.67,32.13 v129.54,32
  Top 0.508: S4.P$1 S3.P$1 S2.P$1 18.01,89.92 17.53,89.44 17.53,89.41 17.02,88.9 17.02,83.06 20.32,79.76 27.94,79.76 28.96,78.74 28.96,76.49 S5.P$2 | U7.8 129.67,36.11 C36.2
  Top 1.829: 3.3V_DCDC_OKI.3 25.65,42.93 15.75,42.93 v13.24,45.43 9.65,49.02 9.65,65.53 FAN.2
  Route2 0.508: 70.61,79.76 45.19,79.76 S4.P$1
  Route2 0.61: 70.61,79.76 v73.66,79.76 v76.2,79.76 76.71,79.76 v77.85,80.9 80.14,83.19 | 80.14,83.19 ENC6.3 ENC5.3 ENC4.3 | 80.14,83.19 91.06,83.19 LIMIT_3.2 LIMIT_2.2 LIMIT_1.2
  Route2 1.829: U1.+3V3_1 60.81,102.46 68.48,102.46 69.6,101.35 ENC1.3 ENC2.3 ENC3.3 70.61,85.09 70.61,79.76 v70.61,74.68
  Route15 0.203: U1.+3V3_2 123.85,102 150.26,102 154.55,97.71 178.38,97.71 179.32,96.77 v179.32,91.69 | 128.27,26.67 131.22,26.67 132.08,25.81 132.69,25.81 v133.1,25.4 | v140.72,10.92 140.72,11.43 139.7,12.45 134.11,12.45 131.57,14.99 131.57,23.39 131.7,23.51 131.7,25.28 130.81,26.16 128.27,26.16 127.76,26.67 | LIMIT_3.2 97.54,86.11 102.87,80.77 v102.87,77.98 | v132.65,92.91 132.96,93.22 v154.69,93.22
  Route15 0.457: v106.43,32.51 106.43,28.19 104.9,26.67 | 104.9,26.67 95.86,26.67 | 95.86,26.67 64.01,26.67 v63.25,27.43 | v95.76,32.51 95.76,26.77 95.86,26.67 | v117.6,32.26 117.6,27.94 116.33,26.67 | 116.33,26.67 104.9,26.67 | v129.54,32 129.54,27.69 128.52,26.67 128.27,26.67 127.76,26.67 116.33,26.67
  Route15 1.829: v70.61,74.68 70.61,73.66 62.99,66.04 v62.99,53.34 61.21,51.56 37.08,51.56 30.48,44.96 13.72,44.96 v13.24,45.43
  Bottom 0.203: v128.65,63.88 128.39,63.88 124.21,59.69 113.38,59.69 v112.27,60.8 | v132.65,92.91 U1.+3V3_2
MAINLINE_CURRENT_SENSOR  (via drill 0.35)
  Top 0.203: C75.1 33.87,29.46 v34.8,29.46 | v49.53,73.41 49.53,74.17 42.42,81.28 U1.PK3
  Top 0.457: R59.1 32.65,30.28 C75.1
  Route2 0.203: v34.8,29.46 35.94,30.61 43.67,30.61 47.24,34.18 47.24,51.05 44.45,53.85 v44.2,53.85
  Bottom 0.203: v44.2,53.85 44.96,54.61 52.83,54.61 53.85,55.63 53.85,61.47 53.34,61.98 53.34,70.87 52.83,71.37 51.56,71.37 v49.53,73.41
MASTER_POWER_ENABLE  (via drill 0.35)
  Top 0.203: TRANSISTOR_DRIVER.4 65.59,33.21 v64.26,34.54
  Top 0.457: TRANSISTOR_DRIVER.4 67.8,32.38 R58.2
  Route2 0.203: U1.PQ1 41.15,57.4 43.18,57.4 43.69,56.9 43.69,55.88 47.75,51.82 47.75,36.58 50.29,34.04 63.75,34.04 v64.26,34.54
MOTOR1_1  (via drill 0.35)
  Top 0.127: MOT1_HB.21 42,45.18 v43.75,46.93 | MOT1_HB.OUTB@1 MOT1_HB.16 44.2,50.18
  Top 0.203: MOT1_HB.15 MOT1_HB.OUTB@1 | MOT1_HB.OUTB 45.27,48.45 v45.27,48.71 | MOT1_HB.OUTB v43.75,46.93 | MOT1_HB.OUTB 43.76,46.93 v43.74,46.93
  Top 0.457: MOT1_HB.16 44.25,49.68 v44.25,48.2
  Top 3.81: MOTOR1.C2 27.88,51.74 40.71,51.74 v44.25,48.2 MOT1_HB.OUTB
  Route2 3.81: v44.25,48.2 40.7,51.75 27.88,51.75 MOTOR1.C2
MOTOR1_2  (via drill 0.35)
  Top 0.127: 44.09,38.93 43.87,38.93 41.66,41.15 39.78,41.15 MOT1_HB.25 | MOT1_HB.30 43.75,35.1 44.25,34.6 45.83,36.18 MOT1_HB.OUTA@1 MOT1_HB.1
  Top 0.254: 44.09,38.93 MOT1_HB.OUTA 44.25,38.41 v44.2,38.35
  Top 3.81: MOT1_HB.OUTA 44.25,34.6 42.67,33.02 35.81,33.02 33.78,35.05 33.78,40.39 27.69,46.48 25.27,46.48 MOTOR1.C1
  Route2 0.254: v43.18,38.35 v44.2,38.35 | v44.2,38.35 44.2,39.12 | 44.31,38.35 v44.2,38.35 | 44.31,38.35 v45.21,38.35 | 25.27,46.48 22.92,48.83 | 44.26,34.8 43.69,35.37 43.69,36.32 42.67,35.31 42.67,33.02 42.67,36.71 44.31,38.35
  Route2 3.81: 22.92,48.83 MOTOR1.C1 | 33.78,35.31 33.78,40.39 27.69,46.48 25.27,46.48 22.99,48.77 | 44.2,34.54 42.67,33.02 38.61,33.02 38.35,33.02 35.81,33.02 33.78,35.05 | 44.13,34.67 44.26,34.8 44.26,37.85
MOTOR1_CURRENT_SENSOR  (via drill 0.35)
  Top 0.203: U1.PK2 44.96,79.76 v51.31,73.41
  Top 0.406: U8.7 74.3,35.69 73.91,36.07 v72.64,36.07 71.03,36.07 C26.1
  Route2 0.203: v72.64,36.07 63.86,36.07 62.21,34.42 50.38,34.42 48.11,36.68 48.11,53.49 v47.75,53.85
  Bottom 0.203: v51.31,73.41 53.85,70.87 53.85,62.23 56.39,59.69 56.39,54.86 55.37,53.85 v47.75,53.85
MOTOR1_INA  (via drill 0.35)
  Top 0.203: v63.75,43.2 63.75,42.93 61.72,40.89 R6.2
  Route2 0.203: v63.75,43.2 63.75,47.24 55.88,55.12 48.51,55.12 U1.PQ2/PA3
MOTOR1_INB
  Top 0.203: R5.2 61.56,49.44 59.31,51.69 | 59.31,51.69 59.18,51.82 | U1.PQ3/PA2 45.97,56.13 46.99,55.12 55.88,55.12 59.31,51.69
MOTOR1_POWER  (via drill 0.35)
  Top 0.152: MOT1_HB.VCC 51.53,43.18 53.08,44.73
  Top 0.203: MOT1_HB.3 55.58,38.35 53.09,38.35 51.82,39.62 v51.05,39.62 | v70.1,41.91 v70.1,39.62 69.19,40.54 68.83,40.54
  Top 0.254: v60.45,37.34 61.09,36.7 v61.09,36.2 61.21,36.32 61.21,36.83 61.72,37.08 v61.72,37.34 | 53.09,44.7 53.08,44.73 51.82,47.75 52.24,48.18 MOT1_HB.13 56.56,48.18 56.64,48.26 56.75,48.15 | MOT1_HB.VCC 51.31,43.18 50.55,44.7 | MOT1_HB.VCC 51.25,39.82 v51.05,39.62 | MOT1_HB.23 MOT1_HB.VCC@1 MOT1_HB.VCC
  Top 0.508: MOT1_HB.12 53.78,47.18 51.25,44.65 MOT1_HB.VCC
  Top 0.813: C1.1 65.54,40.65 65.43,40.54
  Top 3.81: 79.5,30.48 79.5,29.46 79.45,29.52 79.45,36.16 75.07,40.54 68.83,40.54 65.43,40.54 61.21,36.83
  Route2 0.254: 61.21,36.83 61.21,36.32 v61.09,36.2 | v79.5,28.96 79.5,29.46 | v49.78,39.62 v51.05,39.62 v52.32,39.62 | 51.31,43.18 50.55,44.7 51.82,44.26 51.94,44.39 51.82,44.51 51.82,44.7 53.09,44.7
  Route2 3.81: 61.21,36.83 52.83,36.83 v51.05,38.61 51.05,39.37 | 79.5,29.46 79.5,36.07 76.14,39.43 76.14,39.5 75.12,40.51 55.82,40.51 51.94,44.39
  Bottom 0.203: 51.18,38.48 v51.05,38.61
  Bottom 3.81: 61.21,36.83 52.83,36.83 51.18,38.48 | v51.05,38.61 51.05,39.37
  other vias: 78.49,28.96 80.52,28.96 49.28,48.26 51.05,48.26 53.59,48.26 49.28,41.15 51.05,41.15 53.59,41.15
  pour Top (rank 2, no thermals): 81.28,27.69 75.34,27.69 75.34,30.91 81.28,30.91
  pour Route2: 48.26,48.77 48.26,37.59 54.36,37.59 54.36,48.77
MOTOR1_PWM  (via drill 0.35)
  Top 0.203: 62.23,43.94 62.74,43.94 63.5,44.7 63.5,49.78 v58.93,54.36 | v59.69,73.91 83.31,73.91 84.11,74.72 PWM_DRIVER.6
  Top 0.254: R4.2 62.23,43.94
  Bottom 0.203: v58.93,54.36 58.93,73.15 v59.69,73.91
MOTOR2_1  (via drill 0.35)
  Top 0.203: MOT2_HB.OUTA 67.31,59.96 v67.31,60.71 | MOT2_HB.30 65.79,59.23 v65.79,58.67
  Top 0.254: MOT2_HB.1 MOT2_HB.30 65.14,59.44 65.08,59.38 | MOT2_HB.25 70.14,60.48 70.1,60.45 68.96,60.45 MOT2_HB.OUTA
  Top 0.457: MOT2_HB.OUTA@1 MOT2_HB.1
  Top 3.81: MOTOR2.C2 28.07,62.99 61.47,62.99 65.08,59.38 MOT2_HB.OUTA 67.58,59.69 v66.55,59.69
  Route2 3.81: v66.55,59.69 66.04,60.2 64.26,60.2 61.47,62.99 28.19,62.99 26.54,61.34 MOTOR2.C2
MOTOR2_2  (via drill 0.35)
  Top 0.203: MOT2_HB.OUTB@1 78.99,53.27 78.99,57.91 | v77.66,59.38 MOT2_HB.OUTB v75.12,59.38
  Top 0.254: MOT2_HB.21 74.14,60.23 74.42,59.94 75.82,59.94 MOT2_HB.OUTB | MOT2_HB.16 78.17,59.88 v77.67,59.38 78.99,58.05 78.99,57.91 78.99,57.4 79.14,57.26 MOT2_HB.15
  Top 3.81: MOT2_HB.OUTB v77.67,59.38 80.52,62.23 | MOTOR2.C1 27.56,70.36 78.23,70.36 81.28,67.31 81.28,62.99 79.14,60.85 MOT2_HB.16
  Route2 3.81: MOT2_HB.OUTB v77.67,59.38 81.28,62.99 81.28,67.31 78.23,70.36 27.56,70.36 MOTOR2.C1
  other vias: 76.39,59.38
MOTOR2_CURRENT_SENSOR
  Top 0.203: U4.7 84.71,35.94 82.56,38.09 C29.1 82.56,42.47 83.64,43.55 83.64,45.29 88.14,49.78 88.14,63.86 79.23,72.77 56.01,72.77 47.5,81.28 U1.PK1
MOTOR2_INA  (via drill 0.35)
  Top 0.203: R13.2 85.6,48.51 87.12,50.04 87.12,56.64 85.34,58.42 v84.07,58.42
  Route2 0.203: v84.07,58.42 82.55,56.9 62.74,56.9 61.95,57.68 59.79,57.68 58.8,58.67 U1.PK4
MOTOR2_INB  (via drill 0.35)
  Top 0.203: R12.2 84.07,56.22 v84.07,57.54
  Route2 0.203: v84.07,57.54 83.1,56.57 62.56,56.57 61.77,57.35 56.44,57.35 U1.PK5
MOTOR2_POWER  (via drill 0.35)
  Top 0.152: MOT2_HB.VCC 75.05,52.38 77.13,50.29
  Top 0.254: 90.59,29.13 89.6,29.15 U4.4
  Top 0.457: 90.59,29.13 90.68,29.22 v90.68,29.61 90.68,29.72 | 90.6,29.13 90.6,29.64 | 90.6,29.64 90.68,29.72 | v89.58,29.64 90.09,29.13 90.6,29.64 | v91.87,29.64 91.27,29.13 90.68,29.72 | v87.12,43.94 v87.12,44.96 v87.12,45.97
  Top 0.508: v72.14,50.55 MOT2_HB.VCC MOT2_HB.VCC@1 MOT2_HB.23 | MOT2_HB.3 67.14,50.72 67.06,50.8 70.87,50.8 v71.12,50.55 | MOT2_HB.13 77.14,50.29 77.13,50.29 76.2,50.29 76.14,50.23 MOT2_HB.12
  Top 0.813: C2.1 87.97,43.09 v87.12,43.94
  Top 3.81: v87.12,44.96 90.68,41.15 v90.68,29.61
  Route2 0.508: 74.42,52.07 75.18,52.83 75.95,53.59 | v73.15,50.55 v72.14,50.55 v71.12,50.55 | 78.49,49.53 77.52,49.53 76.75,50.29
  Route2 3.81: v87.12,44.96 76.2,44.96 72.14,49.02 v72.14,50.55 | 75.18,52.83 78.49,49.53 87.63,49.53 90.68,46.48 v90.68,29.61 90.68,29.72
  Bottom 3.81: v87.12,44.96 76.2,44.96 72.14,49.02 v72.14,50.55
  other vias: 76.96,50.55 74.93,50.55 76.96,54.86 74.93,54.86 72.14,54.86
  pour Top (rank 2, no thermals): 93.47,31.75 85.6,31.75 85.6,27.88 93.47,27.88
  pour Route2: 66.55,55.37 66.55,49.28 77.72,49.28 77.72,55.63 66.55,55.63
MOTOR2_PWM  (via drill 0.35)
  Top 0.203: R11.2 85.85,51.56 86.61,52.32 86.61,56.13 v85.85,56.9 | v85.85,68.33 84.77,69.41 PWM_DRIVER.7
  Bottom 0.203: v85.85,56.9 v85.85,68.33
MOTOR3_1  (via drill 0.35)
  Top 0.203: 162.56,85.34 163.32,86.11 163.32,86.36 163.18,86.22 MOT3_HB.16 MOT3_HB.OUTB@1 MOT3_HB.15 | MOT3_HB.OUTB 167.08,85.4 168.15,84.33 168.15,80.93 MOT3_HB.21 | MOT3_HB.OUTB 165.93,85.78 v165.61,86.11 | MOT3_HB.OUTB 165.93,83.89 v165.61,83.57
  Top 3.81: MOTOR3.C2 165.61,73.66 161.54,77.72 161.54,84.33 162.56,85.34 165.87,85.34 MOT3_HB.OUTB 165.61,85.08 v165.61,84.84
  Route2 3.81: MOTOR3.C2 165.61,73.66 161.54,77.72 161.54,83.31 163.07,84.84 v165.61,84.84
MOTOR3_2  (via drill 0.35)
  Top 0.203: MOT3_HB.OUTA 174.43,85.28 172.21,83.06 172.21,80.93 MOT3_HB.25 | MOT3_HB.OUTA 176.22,85.4 | MOT3_HB.OUTA 176.68,85.4 MOT3_HB.30 | MOT3_HB.OUTA 174.43,85.78 177.04,88.39 177.04,91.19 | 177.04,91.19 177.04,92.76 MOT3_HB.1 | MOT3_HB.OUTA@1 177.04,91.51 177.04,91.19 | MOT3_HB.OUTA 174.43,85.53 v175.01,86.11 | MOT3_HB.OUTA 174.43,84.14 v175.01,83.57
  Top 3.81: 174.08,73.28 MOTOR3.C1 176.15,73.28 179.07,76.2 179.07,82.55 176.22,85.4 | MOT3_HB.OUTA 174.99,84.84 v175.01,84.84
  Route2 3.81: v175.01,84.84 176.78,84.84 179.07,82.55 179.07,76.2 176.15,73.28 MOTOR3.C1
MOTOR3_CURRENT_SENSOR  (via drill 0.35)
  Top 0.203: U5.7 97.03,34.48 97.03,38.61 | 97.03,38.61 95.67,39.97 C32.1 | 97.03,38.61 99.31,40.89 99.31,43.94 89.15,54.1 89.15,69.34 89.66,69.85 v89.66,71.37 | U1.PK0 50.04,81.03 57.96,73.1 78.99,73.1 | 78.99,73.1 79.37,73.1 | v83.31,71.37 81.58,73.1 78.99,73.1
  Route2 0.203: v89.66,71.37 v83.31,71.37
MOTOR3_INA  (via drill 0.35)
  Top 0.203: R20.2 179.83,97.54 v179.32,98.04
  Route15 0.203: v179.32,98.04 154.69,98.04 150.37,102.36 124.59,102.36 124.11,102.84 119.61,102.84 U1.PC4
MOTOR3_INB  (via drill 0.35)
  Top 0.203: R19.2 180.09,89.92 v179.32,90.68
  Route15 0.203: v179.32,90.68 179.32,90.84 178.72,91.44 178.72,96.87 178.21,97.38 154.41,97.38 150.12,101.67 124.92,101.67 124.11,100.86 117.07,100.86 U1.PC5
MOTOR3_POWER  (via drill 0.35)
  Top 0.152: MOT3_HB.VCC 172.16,92.4 173.99,94.23 | MOT3_HB.VCC 173.28,92.4 173.74,91.95 | MOT3_HB.VCC 174.7,92.4 v174.75,92.46
  Top 0.203: 170.63,92.4 172.41,92.4 | 172.41,92.4 172.72,92.71 | 172.41,92.4 173.28,92.4 173.74,91.95 | 170.41,92.4 MOT3_HB.VCC | 170.41,92.4 170.63,92.4 | 170.63,92.4 171.7,93.47 | MOT3_HB.VCC MOT3_HB.VCC@1 MOT3_HB.23 | MOT3_HB.13 165.18,94.91 165.18,93.65 165.35,93.47 169.33,93.47 170.41,92.4 | MOT3_HB.3 175.18,95.42 173.99,94.23 | MOT3_HB.VCC 169.36,93.22 167.39,93.22
  Top 0.254: v140.72,99.57 v142.24,99.57 v143.76,99.57 144.77,100.57 C3.1
  Top 0.457: v154.43,99.95 v154.43,100.97 v154.43,101.98
  Top 0.508: MOT3_HB.12 166.18,95.06 166.12,95 165.27,95 165.18,94.91
  Top 0.813: C3.1 146.45,100.61 146.81,100.97
  Top 3.81: v154.43,100.97 146.81,100.97 130.94,100.97 123.19,93.22 v106.93,93.22 93.55,79.83 93.55,53.11 102.62,44.05 v102.62,29.97
  Route2 0.203: 173.74,91.95 173.99,92.2 173.99,93.98 174.5,93.98 174.75,94.23 175.01,93.98 175.26,94.23 175.26,94.74 175.13,94.87 | 173.99,95.76 171.7,93.47 | 175.13,94.87 173.99,96.01 | 173.99,94.23 174.5,94.23 175.13,94.87
  Route2 3.81: 172.72,92.71 173.99,93.98 173.99,94.23 173.99,98.04 171.07,100.97 v154.43,100.97 | 102.62,29.72 102.62,44.07 100.97,45.72 100.9,45.72 93.53,53.09 93.53,79.82 v106.93,93.22 123.19,93.22 130.94,100.97 148.72,100.97 152.65,97.03 163.32,97.03 167.39,92.96
  Bottom 3.81: v154.43,100.97 171.07,100.97 173.99,98.04 173.99,93.98 172.72,92.71
  other vias: 101.35,29.97 103.89,29.97 169.93,94.74 165.61,94.74 165.61,92.46 165.61,90.17 169.93,92.46 169.93,90.17 174.75,94.74 174.75,90.17 172.72,94.74
  pour Top (rank 2, no thermals): 98.04,31.5 98.04,27.88 104.39,27.88 104.39,31.5
  pour Route2: 164.85,95.5 175.77,95.5 175.77,89.15 164.59,89.15 164.59,95.5
MOTOR3_PWM  (via drill 0.35)
  Top 0.203: R18.2 180.35,93.57 179.61,93.57 178.72,92.67 178.72,90.43 179.32,89.82 v179.32,89.15 | PWM_DRIVER.8 85.42,76.53 88.9,80.01 89.41,80.01 89.92,80.52 89.92,81.03 92.71,83.82 92.71,86.91 103.46,97.66 123.57,97.66 124.71,98.81 124.71,99.72 v125.73,100.73
  Route15 0.203: v179.32,89.15 160.69,89.15 155.86,93.98 155.86,94.84 149.69,101.01 126.01,101.01 v125.73,100.73
MOTOR4_1  (via drill 0.35)
  Top 0.203: MOT4_HB.1 MOT4_HB.OUTA@1 153.05,81.68 152.91,81.53 152.91,80.72 MOT4_HB.30 151.89,80.58 151.39,81.08 150.94,81.08 | MOT4_HB.25 148.05,79.22 148.08,79.25 148.47,79.25 MOT4_HB.OUTA | MOT4_HB.OUTA 149.92,81.08 v149.47,80.64 | MOT4_HB.OUTA 151.57,81.08 v152.01,80.64
  Top 3.81: 150.94,81.08 151.07,81.08 | MOTOR4.C2 165.61,66.42 150.94,81.08 | 150.94,81.08 MOT4_HB.OUTA
  Route2 3.81: 151.39,80.64 v150.74,80.64 151.39,80.64 | 165.61,66.42 MOTOR4.C2 165.61,66.42 158.69,73.34 151.39,80.64
MOTOR4_2  (via drill 0.35)
  Top 0.203: 139.05,87.61 MOT4_HB.15 | 139.05,87.61 MOT4_HB.OUTB@1 | 140.26,81.08 MOT4_HB.OUTB | 139.05,87.61 138.94,87.5 138.94,83.31 v140.72,81.53 141.35,81.53 MOT4_HB.OUTB | MOT4_HB.OUTB 139.55,81.08 MOT4_HB.16 | MOT4_HB.21 144.05,79.47 144.02,79.5 143.38,79.5 MOT4_HB.OUTB | MOT4_HB.OUTB 140.72,80 v140.72,79.5
  Top 3.81: 140.26,81.08 137.41,78.23 137.41,73.38 139.82,70.97 155.09,70.97 160.76,65.31 160.76,63.4 163.6,60.55 167.62,60.55 172.47,65.41 MOTOR4.C1 | MOT4_HB.OUTB 141.28,81.08 v140.72,80.52
  Route2 3.81: v140.72,80.52 139.7,80.52 137.44,78.26 137.44,73.37 139.86,70.95 155.11,70.95 160.76,65.31 160.76,63.4 163.6,60.55 167.62,60.55 172.47,65.41 MOTOR4.C1
MOTOR4_CURRENT_SENSOR  (via drill 0.35)
  Top 0.203: 108.04,34.56 U9.7 107.82,41.95 C41.1 108.04,50.03 v107.95,50.12
  Route15 0.203: v107.95,50.12 107.95,55.24 107.47,55.72 107.47,59.21 108.46,60.2 116.33,60.2 118.36,62.23 118.36,94.49 U1.PE2
MOTOR4_INA  (via drill 0.35)
  Top 0.203: R27.2 157.14,93.56 v156.46,94.23
  Route15 0.203: v156.46,94.23 156.46,94.74 149.87,101.34 125.05,101.34 124.25,100.53 116,100.53 114.68,101.85 U1.PC6
MOTOR4_INB  (via drill 0.35)
  Top 0.203: R26.2 133.77,91.69 v131.83,91.69
  Bottom 0.203: U1.PE5 111.99,100.86 124.22,100.86 127.51,97.58 127.51,97.54 131.32,93.73 131.32,92.96 131.83,92.46 v131.83,91.69
MOTOR4_POWER  (via drill 0.35)
  Top 0.152: MOT4_HB.VCC 147.63,89.66 | MOT4_HB.VCC 142.04,88.08 v141.99,88.14 | MOT4_HB.VCC 144.14,88.08 142.05,90.17 | MOT4_HB.VCC 143.47,88.08 141.05,90.5 | MOT4_HB.VCC 144.42,88.08 142.05,90.45
  Top 0.203: MOT4_HB.VCC MOT4_HB.VCC@1 MOT4_HB.23 | MOT4_HB.VCC 148.79,88.08 151.13,90.42 151.13,92.5 MOT4_HB.3 | MOT4_HB.13 141.05,90.5 140.97,90.42 | MOT4_HB.VCC 143.82,88.08 | MOT4_HB.VCC 142.8,88.08 | 147.63,89.66 148.34,89.66 | v120.24,88.24 v120.24,89.51 119.74,89 119.63,89
  Top 0.508: MOT4_HB.12 142.05,90.45 142.05,90.17 141.89,90.01 | MOT4_HB.VCC 142.18,88.08 141.99,87.88
  Top 0.813: C4.1 108.91,89.23 108.68,89
  Top 3.81: v135.99,89 119.63,89 108.68,89 97.77,78.09 97.77,54.86 99.82,52.81 109.06,52.81 113.54,48.33 113.54,30.73 113.03,30.23 v113.54,29.72
  Route2 0.203: 141.99,88.9 141.88,89
  Route2 3.81: 141.88,89 v135.99,89 | 146.94,89.53 146.94,91.25 145.29,92.9 145.22,92.9 141.6,96.52 132.46,96.52 124.94,89 108.68,89 97.75,78.07 97.75,54.87 99.56,53.06 99.59,53.06 99.82,52.83 109.04,52.83 113.54,48.33 v113.54,29.72
  Bottom 0.203: v135.99,90.02 v135.99,89 136.02,89.03 136.02,88.01 v135.99,87.99
  Bottom 3.81: 136.02,89.03 141.92,89.03
  other vias: 114.81,29.72 112.27,29.72 141.99,85.85 141.99,90.42 146.3,90.42 150.88,90.42 150.88,85.85 146.05,85.85 146.3,88.14 150.88,88.14 141.99,89.28
  pour Top (rank 2, no thermals): 108.71,27.69 108.71,31.75 116.08,31.75 116.08,27.69
  pour Route2: 140.46,91.19 151.64,91.19 151.64,85.09 140.46,85.09
MOTOR4_PWM  (via drill 0.35)
  Top 0.203: R25.2 156.72,89.66 153.92,92.46 153.92,93.73 154.54,94.34 v154.69,94.34 | v122.68,97.03 122.38,97.33 103.6,97.33 102.58,96.31 102.58,96.22 95.25,88.9 95.25,85.89 94.42,85.05 94.41,85.05 90.25,80.89 90.25,80.38 89.55,79.68 89.04,79.68 86.06,76.71 PWM_DRIVER.9
  Route15 0.203: v122.68,97.03 123.7,97.03 127.25,100.58 149.61,100.58 154.69,95.5 v154.69,94.34
MOTOR5_1  (via drill 0.35)
  Top 0.203: MOT5_HB.OUTB 122.12,73.35 122.94,74.17 126.59,74.17 MOT5_HB.21 | MOT5_HB.OUTB 122.12,71.83 119.63,69.34 116.08,69.34 | 116.08,69.34 116,69.34 MOT5_HB.OUTB@1 | MOT5_HB.15 115.94,69.2 116.08,69.34 | MOT5_HB.OUTB 121.41,71.24 v121.41,70.87 | MOT5_HB.OUTB 123.2,70.87 v124.21,70.87 | MOT5_HB.OUTB 122.12,70.41 | MOT5_HB.OUTB 122.12,69.7 MOT5_HB.16
  Top 3.81: 122.12,70.41 124.97,67.56 130.06,67.56 135.09,62.54 149.55,62.54 156.53,55.56 MOTOR5.C2 | MOT5_HB.OUTB 122.68,71.39 v122.68,70.87
  Route2 3.81: 127.09,67.59 127.12,67.56 130.05,67.56 | 136.28,62.55 136.3,62.52 | 136.3,62.52 149.61,62.52 156.57,55.56 MOTOR5.C2 | 136.3,62.52 135.1,62.52 132.19,65.44 132.18,65.44 130.05,67.56 | 130.05,67.56 130.02,67.59 124.94,67.59 122.68,69.85 v122.68,70.87
MOTOR5_2  (via drill 0.35)
  Top 0.203: MOT5_HB.OUTA 122.12,80.32 124.21,78.23 126.59,78.23 MOT5_HB.25 | 122.05,83.19 122.12,83.11 v122.12,82.3 MOT5_HB.OUTA | 122.05,83.19 121.92,83.31 121.81,83.2 MOT5_HB.OUTA@1 MOT5_HB.1 | MOT5_HB.30 122.06,83.2 122.05,83.19 | MOT5_HB.OUTA 122.62,80.95 MOT5_HB.30 | MOT5_HB.30 123.39,82.43 v123.39,82.3 | MOT5_HB.OUTA 120.85,81.72 v120.85,82.3
  Top 3.81: 121.92,83.31 123.39,84.78 131.12,84.78 133.2,82.7 133.2,71.64 138.08,66.75 153.35,66.75 v156.54,63.56
  Route2 3.81: v122.12,82.3 122.12,83.51 123.39,84.78 131.12,84.78 133.1,82.8 133.1,82.74 133.22,82.61 133.22,71.63 135.76,69.09 135.76,69.03 138.05,66.74 153.35,66.74 v156.53,63.56 v156.54,63.56
  Route15 0.203: v155.78,62.8 v156.54,63.56 v157.3,64.32
  Route15 3.81: 173.55,55.56 173.55,57.66 170.75,60.45 159.64,60.45 v156.54,63.55 v156.54,63.56
  Bottom 3.81: v156.54,63.56 159.65,60.45 170.69,60.45 173.48,57.66 MOTOR5.C1
MOTOR5_CURRENT_SENSOR  (via drill 0.35)
  Top 0.203: U6.7 119,41.19 C35.1 119.72,52.74 118.62,53.85 v118.11,53.85
  Route15 0.203: v118.11,53.85 118.11,55.24 117.63,55.72 117.63,59.72 118.7,60.78 118.7,96.69 U1.PE1
MOTOR5_INA  (via drill 0.35)
  Top 0.203: R34.2 105.07,81.45 v108.97,85.34
  Route15 0.203: v108.97,85.34 111,87.38 U1.PE3
MOTOR5_INB  (via drill 0.35)
  Top 0.203: 105.07,73.3 R33.2 104.14,73.15 v103.38,73.91
  Route15 0.203: 103.48,80.01 103.48,79.99 | 103.48,80.01 103.48,96.67 U1.PM5 | v103.38,73.91 103.12,74.17 103.12,76.45 103.48,76.81 103.48,80.01
MOTOR5_POWER  (via drill 0.35)
  Top 0.152: MOT5_HB.VCC@1 MOT5_HB.VCC | MOT5_HB.VCC 115.12,75.75 112.78,73.41 | MOT5_HB.VCC 115.12,74.22 113.16,72.26 112.78,71.88 v112.78,71.37 112.6,71.2 MOT5_HB.13 | MOT5_HB.VCC 115.12,72.7 | MOT5_HB.3 114.38,81.2 114.81,80.77 114.81,79.5
  Top 0.203: MOT5_HB.VCC@1 MOT5_HB.23 | MOT5_HB.VCC 116.08,77.16 | MOT5_HB.VCC 114.05,77.27 114.05,80.01 114.55,79.5 114.81,79.5 | MOT5_HB.VCC 113.54,77.78 113.54,79.25 | v121.67,65.28 120.9,66.04 v120.65,66.04 120.65,65.53 | v122.68,64.52 122.68,63.5 122.83,63.35
  Top 0.457: v114.55,63.5 114.71,63.35
  Top 0.508: MOT5_HB.12 113.09,72.2 113.16,72.26
  Top 0.813: C8.1 116.95,65.16 116.59,65.53
  Top 3.81: v114.55,63.5 116.59,65.53 120.65,65.53 122.83,63.35 125.37,63.35 127.76,60.96 127.76,49.02 125.98,47.24 125.98,29.46 125.85,29.6 v125.85,30.6
  Route2 3.81: v114.55,63.5 114.3,63.5 112.78,65.02 112.78,71.88 113.54,72.64 | v125.85,30.6 125.98,30.73 125.98,47.24 127.76,49.02 127.76,60.96 125.35,63.37 122.81,63.37 116.84,69.34 116.84,74.42 114.81,76.45 114.81,79.25
  Route15 0.203: v113.79,62.74 v114.55,63.5 v115.32,64.26
  Bottom 3.81: 113.54,72.64 112.78,71.88 112.78,65.02 114.3,63.5 v114.55,63.5
  other vias: 112.78,81.03 126.86,29.84 124.83,31.61 115.06,81.03 117.35,81.03 117.35,76.2 115.06,76.2 112.78,76.2 115.06,71.37 117.35,71.37 112.78,73.15 113.79,72.39
  pour Top (rank 2, no thermals): 119.89,27.69 119.89,31.5 128.02,31.5 128.02,27.69
  pour Route2: 112.01,81.53 112.01,70.61 118.36,70.61 118.36,81.79 112.01,81.79
MOTOR5_PWM  (via drill 0.35)
  Top 0.203: R32.2 103.76,77.72 v100.45,74.42 | v90.68,78.49 88.31,78.49 86.72,76.89 PWM_DRIVER.10
  Route15 0.203: v100.45,74.42 94.74,74.42 v90.68,78.49
MOTOR6_1  (via drill 0.35)
  Top 0.203: 147.52,50.22 MOT6_HB.OUTA | 147.52,50.22 v148.53,51.24 | MOT6_HB.OUTA v148.28,50.22 | v148.28,50.22 v149.55,51.49 | MOT6_HB.OUTA v149.55,50.22 | MOT6_HB.OUTA v148.28,50.22 | v149.54,48.96 v148.28,50.22 | v149.54,48.96 v149.55,48.95 | MOT6_HB.OUTA 147.52,50.22 | 147.52,50.22 v148.53,49.21 | MOT6_HB.25 149.64,47.97 149.61,48.01 149.61,48.9 v149.54,48.96 | MOT6_HB.OUTA 147.26,52.47 MOT6_HB.30 140.21,52.97 | 140.21,52.97 MOT6_HB.1 | MOT6_HB.OUTA@1 140.21,52.97
  Route15 3.81: v149.55,50.22 158.94,50.22 161.54,47.62 MOTOR6.C2
  Bottom 3.81: 149.48,50.23 158.94,50.23 161.54,47.62 MOTOR6.C2
MOTOR6_2  (via drill 0.35)
  Top 0.203: MOT6_HB.21 148.81,43.97 148.59,44.2 148.59,43.05 MOT6_HB.OUTB | 147.26,40.19 v147.26,41.15 147.26,39.47 147.34,39.39 | 147.34,39.39 MOT6_HB.16 | 147.34,39.39 146.92,38.97 MOT6_HB.OUTB@1 MOT6_HB.15 | MOT6_HB.OUTB 146.69,41.15 v145.99,41.15 | MOT6_HB.OUTB 147.84,41.15 v148.53,41.15
  Top 3.81: 147.26,40.19 150.11,37.34 155.7,37.34 161.14,42.77 167.62,42.77 172.47,47.62 MOTOR6.C1 | MOT6_HB.OUTB v147.26,41.15
  Route2 3.81: v147.26,41.15 147.26,40.19 150.11,37.34 155.7,37.34 161.14,42.77 167.62,42.77 172.47,47.62 MOTOR6.C1
MOTOR6_CURRENT_SENSOR  (via drill 0.35)
  Top 0.203: v130.45,53.59 130.18,53.32 130.18,48.02 128.4,46.24 128.4,42.8 130.64,40.55 C38.1 130.94,39.84 U7.7
  Route15 0.203: v130.45,53.59 130.45,56.49 125.68,61.26 119.84,61.26 119.03,62.08 119.03,98.91 U1.PE0
MOTOR6_INA  (via drill 0.35)
  Top 0.203: R41.2 138.43,58.93 137.79,59.56 | 137.79,59.56 137.67,59.69 | 137.79,59.56 137.23,60.12 133.7,60.12 v131.07,62.75
  Bottom 0.203: v131.07,62.75 127.77,62.75 U1.PF1
MOTOR6_INB  (via drill 0.35)
  Top 0.203: R40.2 130.81,59.08 v130.45,59.44
  Bottom 0.203: v130.45,59.44 126.75,59.44 124.97,57.66 122.17,57.66 U1.PF2
MOTOR6_POWER  (via drill 0.35)
  Top 0.152: v142.49,41.66 142.34,41.81 141.12,41.81 140.26,42.67 MOT6_HB.VCC | MOT6_HB.13 137.24,40.97 v137.92,41.66
  Top 0.203: MOT6_HB.VCC MOT6_HB.VCC@1 MOT6_HB.23 | MOT6_HB.3 139.78,50.97 139.95,50.8 139.95,46.28 MOT6_HB.VCC | MOT6_HB.VCC 140.26,45.41 140.46,45.21 | v140.97,36.07 141.48,35.56 v141.99,35.56
  Top 0.508: 138.11,41.97 MOT6_HB.12 | 138.11,41.97 138.18,41.91 | MOT6_HB.VCC 140.26,44.13 138.11,41.97
  Top 3.81: 133.86,29.21 135.89,31.24 | 135.89,31.24 135.89,31.59 | 135.89,31.24 136.09,31.44 136.09,34.23 137.92,36.07 v140.97,36.07 142.99,36.07 C7.1
  Route2 0.203: 140.46,46.23 139.95,45.72 | v135.13,30.48 v135.89,29.72
  Route2 3.81: v140.97,36.07 141.48,36.83 141.48,42.16 | v135.13,30.48 136.08,31.43 136.08,34.23 136.91,35.05 136.91,44.2 139.7,46.99
  Bottom 0.203: v139.95,36.58 140.46,36.58 v140.97,36.07 141.48,35.56
  Bottom 3.81: 141.48,42.16 141.48,36.83 v140.97,36.07
  other vias: 137.92,47.75 134.37,31.24 140.21,47.75 142.49,47.75 142.49,45.97 140.21,45.97 137.92,45.97 140.21,41.66
  pour Top (rank 2, no thermals): 131.83,31.24 131.83,27.37 134.87,27.37 134.87,31.24
  pour Route2: 143.26,51.56 143.26,40.39 137.16,40.39 137.16,51.56
MOTOR6_PWM  (via drill 0.35)
  Top 0.203: R39.2 135.38,58.48 134.33,59.53 133.76,59.53 131.15,62.14 130.82,62.14 130.47,62.5 130.47,63.34 129.16,64.64 v127.89,64.64 | v90.68,77.22 87.63,77.22 87.38,76.96 87.38,75.33 PWM_DRIVER.11
  Route15 0.203: v110.74,60.8 97.46,74.09 94.61,74.09 91.48,77.22 v90.68,77.22
  Bottom 0.203: v127.89,64.64 127.76,64.52 127.76,63.75 124.21,60.2 113.79,60.2 112.58,61.41 112.02,61.41 111.41,60.8 v110.74,60.8
MOTOR7_1  (via drill 0.35)
  Top 0.203: MOT7_HB.1 MOT7_HB.OUTA@1 | v153.61,28.38 MOT7_HB.OUTA v151.07,28.38
  Top 0.508: MOT7_HB.OUTA@1 MOT7_HB.30 152.84,28.88 MOT7_HB.OUTA 154.43,26.29 154.43,26.16 154.46,26.13 MOT7_HB.25
  Top 3.81: MOT7_HB.OUTA 152.34,29.15 155.89,32.7 160.58,32.7 MOTOR7.C2
  Route2 3.81: MOT7_HB.OUTA 152.34,29.15 155.89,32.7 160.59,32.7 163.51,35.62 | 163.51,35.62 165.04,37.15 | 163.51,35.62 MOTOR7.C2
  other vias: 152.34,28.38
MOTOR7_2  (via drill 0.35)